# Altium project MISKO3 v1.0.PrjPcb (part 1 of 2)
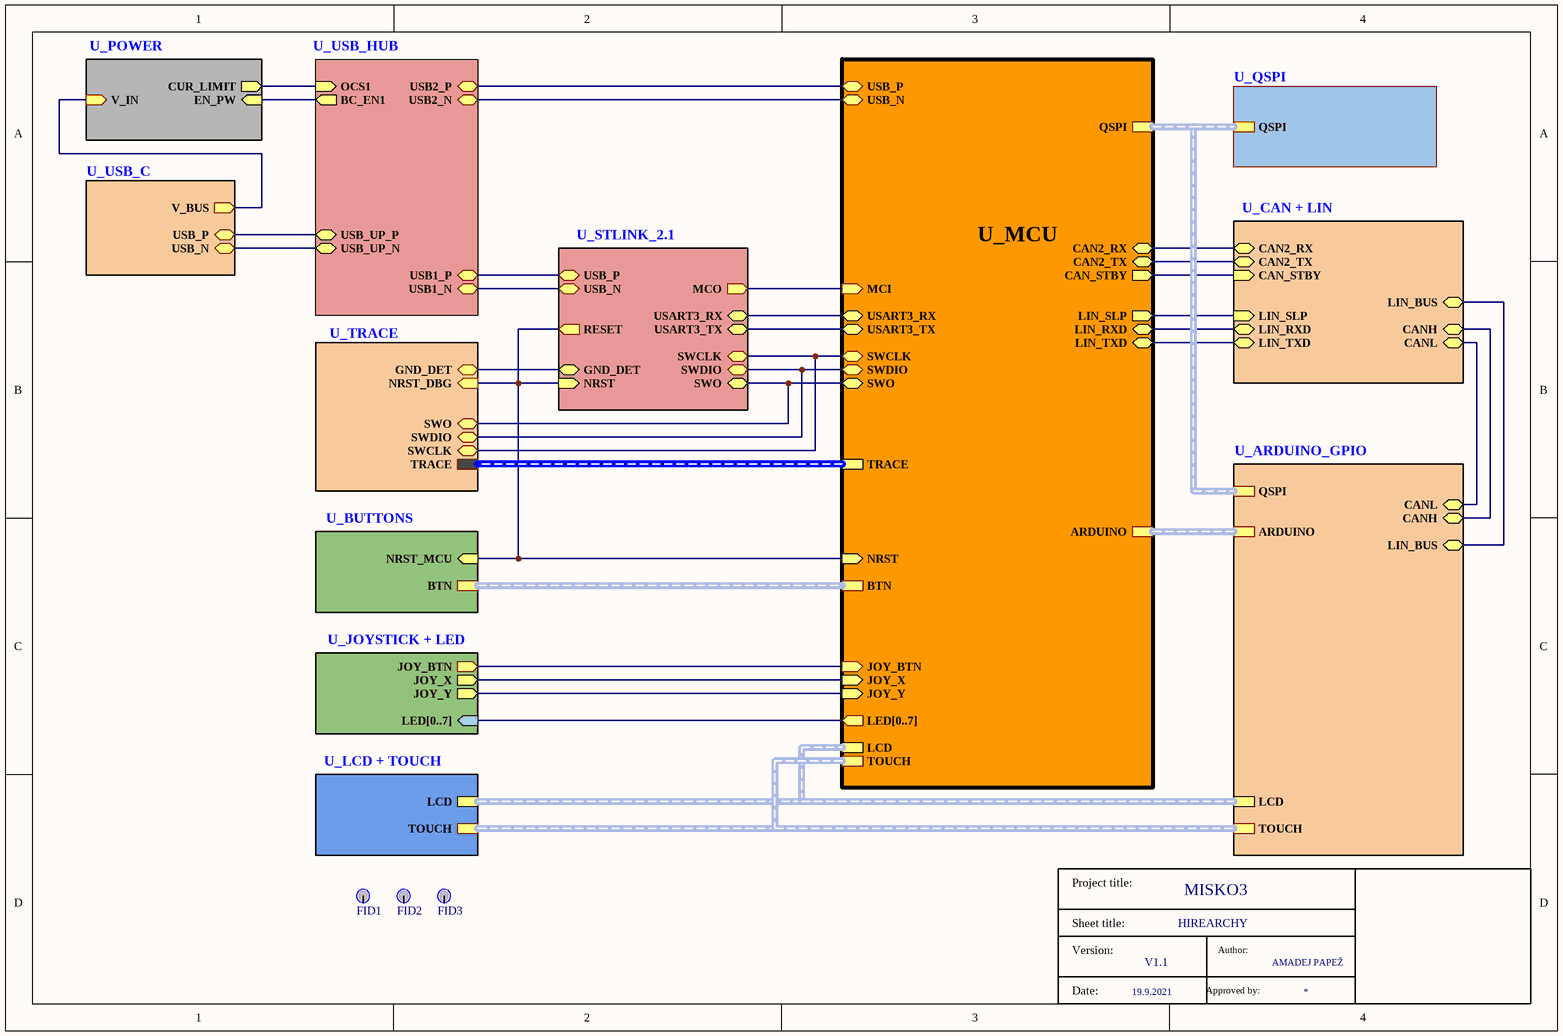
[diagram p0: HIREARCHY.SchDoc]
13 sheets, 243 parts. Net scope: hierarchical (ports join the sheet entries above them; power ports are global).
Board files: Misko 3 1.0.PcbDoc, Misko 3 1.0 panel.PcbDoc
Sheets:
  HIREARCHY.SchDoc
    U_BUTTONS = BUTTONS.SchDoc
    U_ARDUINO_GPIO = ARDUINO_GPIO.SchDoc
    U_POWER = POWER.SchDoc
    U_USB_HUB = USB_HUB.SchDoc
    U_JOYSTICK + LED = JOYSTICK + LED.SchDoc
    U_CAN + LIN = CAN + LIN.SchDoc
    U_STLINK_2.1 = STLINK_2.1.SchDoc
    U_MCU = MCU.SchDoc
    U_USB_C = USB_C.SchDoc
    U_QSPI = QSPI.SchDoc
    U_LCD + TOUCH = LCD + TOUCH .SchDoc
    U_TRACE = Trace.SchDoc

## Sheet HIREARCHY.SchDoc: MISKO3
size A4; Date: 19.9.2021; Author: AMADEJ PAPEŽ; SheetNumber: 1; SheetTotal: 13; SheetTitle: HIREARCHY; Version: V1.1

### Parts
FID1  Fiducial  [Fiducial]  (value not drawn)
FID2  Fiducial  [Fiducial]  (value not drawn)
FID3  Fiducial  [Fiducial]  (value not drawn)
T1  (no value)

### Sub-sheets
U_ARDUINO_GPIO = ARDUINO_GPIO.SchDoc: LIN_BUS (bidir), CANH (bidir), CANL (bidir), LCD (harness LCD), TOUCH (harness TOUCH), ARDUINO (harness ARDUINO), QSPI (harness QSPI)
U_BUTTONS = BUTTONS.SchDoc: NRST_MCU (in), BTN (harness BTN)
U_CAN + LIN = CAN + LIN.SchDoc: LIN_SLP (in), LIN_RXD (bidir), LIN_TXD (bidir), LIN_BUS (bidir), CAN_STBY (in), CAN2_TX (bidir), CAN2_RX (bidir), CANH (bidir), CANL (bidir)
U_JOYSTICK + LED = JOYSTICK + LED.SchDoc: JOY_X (out), JOY_Y (out), LED[0..7] (in, harness LED_BUS), JOY_BTN (out)
U_LCD + TOUCH = LCD + TOUCH .SchDoc: LCD (harness LCD), TOUCH (harness TOUCH)
U_MCU = MCU.SchDoc: CAN_STBY (out), JOY_Y (in), JOY_X (in), CAN2_TX (bidir), CAN2_RX (bidir), TRACE (harness TRACE), LIN_TXD (bidir), NRST (in), SWO (bidir), LIN_SLP (out), LIN_RXD (bidir), MCI (in), SWDIO (bidir), SWCLK (bidir), JOY_BTN (in), USB_N (bidir), USB_P (bidir), LCD (harness LCD), TOUCH (harness TOUCH), QSPI (harness QSPI), BTN (harness BTN), LED[0..7] (out, harness LED), ARDUINO (harness ARDUINO), USART3_TX (bidir), USART3_RX (bidir)
U_POWER = POWER.SchDoc: EN_PW (in), CUR_LIMIT (out), V_IN (in)
U_QSPI = QSPI.SchDoc: QSPI (harness QSPI)
U_STLINK_2.1 = STLINK_2.1.SchDoc: GND_DET (bidir), USART3_RX (bidir), USART3_TX (bidir), SWO (bidir), NRST (in), MCO (out), SWCLK (bidir), SWDIO (bidir), USB_P (bidir), USB_N (bidir), RESET (out)
U_TRACE = Trace.SchDoc: GND_DET (bidir), TRACE (harness TRACE), NRST_DBG (in), SWO (bidir), SWCLK (bidir), SWDIO (bidir)
U_USB_C = USB_C.SchDoc: USB_P (bidir), USB_N (bidir), V_BUS (out)
U_USB_HUB = USB_HUB.SchDoc: USB_UP_P (bidir), USB_UP_N (bidir), BC_EN1 (out), OCS1 (in), USB2_N (bidir), USB2_P (bidir), USB1_N (bidir), USB1_P (bidir)

### Nets
BC_EN1: sheet U_POWER/EN_PW, sheet U_USB_HUB/BC_EN1
CAN2_RX: sheet U_CAN + LIN/CAN2_RX, sheet U_MCU/CAN2_RX
CAN2_TX: sheet U_CAN + LIN/CAN2_TX, sheet U_MCU/CAN2_TX
CAN_STBY: sheet U_CAN + LIN/CAN_STBY, sheet U_MCU/CAN_STBY
CANH: sheet U_ARDUINO_GPIO/CANH, sheet U_CAN + LIN/CANH
CANL: sheet U_ARDUINO_GPIO/CANL, sheet U_CAN + LIN/CANL
CUR_LIMIT: sheet U_POWER/CUR_LIMIT, sheet U_USB_HUB/OCS1
JOY_BTN: sheet U_JOYSTICK + LED/JOY_BTN, sheet U_MCU/JOY_BTN
JOY_X: sheet U_JOYSTICK + LED/JOY_X, sheet U_MCU/JOY_X
JOY_Y: sheet U_JOYSTICK + LED/JOY_Y, sheet U_MCU/JOY_Y
LIN_BUS: sheet U_ARDUINO_GPIO/LIN_BUS, sheet U_CAN + LIN/LIN_BUS
LIN_SLP: sheet U_CAN + LIN/LIN_SLP, sheet U_MCU/LIN_SLP
MCI: sheet U_STLINK_2.1/MCO, sheet U_MCU/MCI
NRST: sheet U_BUTTONS/NRST_MCU, sheet U_STLINK_2.1/NRST, sheet U_STLINK_2.1/RESET, sheet U_MCU/NRST, sheet U_TRACE/NRST_DBG
STM_JRST: sheet U_STLINK_2.1/GND_DET, sheet U_TRACE/GND_DET
T_JTCK: sheet U_STLINK_2.1/SWCLK, sheet U_MCU/SWCLK, sheet U_TRACE/SWCLK
T_JTMS: sheet U_STLINK_2.1/SWDIO, sheet U_MCU/SWDIO, sheet U_TRACE/SWDIO
T_SWO: sheet U_STLINK_2.1/SWO, sheet U_MCU/SWO, sheet U_TRACE/SWO
USART3_RX: sheet U_STLINK_2.1/USART3_RX, sheet U_MCU/USART3_RX
USART3_TX: sheet U_STLINK_2.1/USART3_TX, sheet U_MCU/USART3_TX
USART5_RX: sheet U_CAN + LIN/LIN_RXD, sheet U_MCU/LIN_RXD
USART5_TX: sheet U_CAN + LIN/LIN_TXD, sheet U_MCU/LIN_TXD
USB2_N: sheet U_USB_HUB/USB2_N, sheet U_MCU/USB_N
USB2_P: sheet U_USB_HUB/USB2_P, sheet U_MCU/USB_P
USB_N: sheet U_USB_HUB/USB_UP_N, sheet U_USB_C/USB_N
USB_P: sheet U_USB_HUB/USB_UP_P, sheet U_USB_C/USB_P
USB_STLINK_N: sheet U_USB_HUB/USB1_N, sheet U_STLINK_2.1/USB_N
USB_STLINK_P: sheet U_USB_HUB/USB1_P, sheet U_STLINK_2.1/USB_P
V_BUS: sheet U_POWER/V_IN, sheet U_USB_C/V_BUS

Not connected (* = marked no-connect by the designer): FID1 F; FID2 F; FID3 F

### Buses and harness runs
harness sheet U_ARDUINO_GPIO/ARDUINO = sheet U_MCU/ARDUINO
harness sheet U_ARDUINO_GPIO/LCD = sheet U_LCD + TOUCH/LCD = sheet U_MCU/LCD
harness sheet U_ARDUINO_GPIO/QSPI = sheet U_MCU/QSPI = sheet U_QSPI/QSPI
harness sheet U_ARDUINO_GPIO/TOUCH = sheet U_LCD + TOUCH/TOUCH = sheet U_MCU/TOUCH
harness sheet U_BUTTONS/BTN = sheet U_MCU/BTN
harness sheet U_MCU/TRACE = sheet U_TRACE/TRACE

### Notes on the sheet
- (in symbol Title block) Project title:; Sheet title:; Version:; Author:; Date:; Approved by:

### Library data of the parts
FID1-FID3 = Fiducial: according to IPC-7351 - is a 1mm diameter round dot with 2mm solder mask opening; Voltage: 50V; Tolerance: 5%; max.Temperature: +125; min.Temperature: -40
T1 = Title block

## Sheet BUTTONS.SchDoc: MISKO 3.0
size A4; Date: 19.9.2021; Author: AMADEJ PAPEŽ; SheetNumber: 10; SheetTotal: 13; SheetTitle: BUTTONS; Version: V1.1
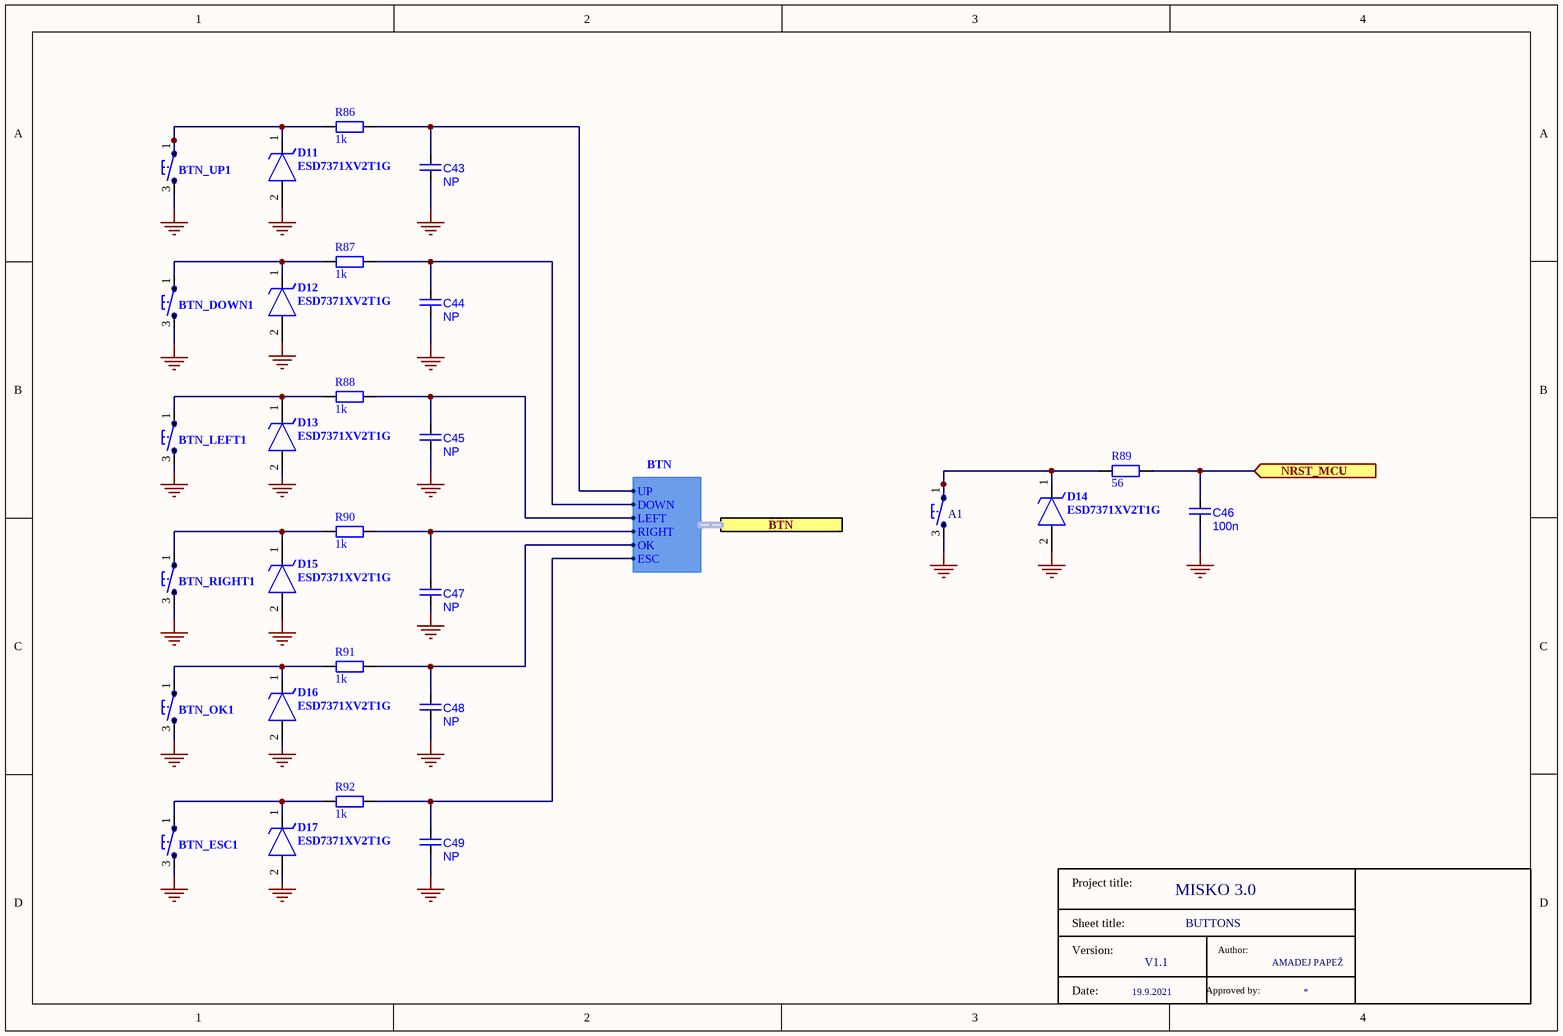
[diagram p1: BUTTONS.SchDoc]

### Parts
A1  Button_6x6  [Tipka 6x6]  (value not drawn)
BTN_DOWN1  Button_6x6  [Tipka 6x6]  (value not drawn)
BTN_ESC1  Button_6x6  [Tipka 6x6]  (value not drawn)
BTN_LEFT1  Button_6x6  [Tipka 6x6]  (value not drawn)
BTN_OK1  Button_6x6  [Tipka 6x6]  (value not drawn)
BTN_RIGHT1  Button_6x6  [Tipka 6x6]  (value not drawn)
BTN_UP1  Button_6x6  [Tipka 6x6]  (value not drawn)
C43  value NP  [C0603]
C44  value NP  [C0603]
C45  value NP  [C0603]
C46  value 100n  [C0603]
C47  value NP  [C0603]
C48  value NP  [C0603]
C49  value NP  [C0603]
D11  ESD7371XV2T1G  [SOD1608X70N]
D12  ESD7371XV2T1G  [SOD1608X70N]
D13  ESD7371XV2T1G  [SOD1608X70N]
D14  ESD7371XV2T1G  [SOD1608X70N]
D15  ESD7371XV2T1G  [SOD1608X70N]
D16  ESD7371XV2T1G  [SOD1608X70N]
D17  ESD7371XV2T1G  [SOD1608X70N]
R86  value 1k  [R1608_0603I_L]
R87  value 1k  [R1608_0603I_L]
R88  value 1k  [R1608_0603I_L]
R89  value 56  [R1608_0603I_L]
R90  value 1k  [R1608_0603I_L]
R91  value 1k  [R1608_0603I_L]
R92  value 1k  [R1608_0603I_L]
T10  (no value)

### Ports
BTN (harness BTN), NRST_MCU (in)

### Harnesses
BTN: LEFT, DOWN, RIGHT, UP, OK, ESC

### Nets
GND: A1.3 BTN_DOWN1.3 BTN_ESC1.3 BTN_LEFT1.3 BTN_OK1.3 BTN_RIGHT1.3 BTN_UP1.3 C43.1 C44.1 C45.1 C46.1 C47.1 C48.1 C49.1 D11.2(A) D12.2(A) D13.2(A) D14.2(A) D15.2(A) D16.2(A) D17.2(A)
NRST: C46.2 R89.1 ; port NRST_MCU
NetA1_1: A1.1 D14.1(K) R89.2
NetBTN_DOWN1_1: BTN_DOWN1.1 D12.1(K) R87.2
NetBTN_ESC1_1: BTN_ESC1.1 D17.1(K) R92.2
NetBTN_LEFT1_1: BTN_LEFT1.1 D13.1(K) R88.2
NetBTN_OK1_1: BTN_OK1.1 D16.1(K) R91.2
NetBTN_RIGHT1_1: BTN_RIGHT1.1 D15.1(K) R90.2
NetBTN_UP1_1: BTN_UP1.1 D11.1(K) R86.2
NetC43_2: C43.2 R86.1 ; port BTN.UP
NetC44_2: C44.2 R87.1 ; port BTN.DOWN
NetC45_2: C45.2 R88.1 ; port BTN.LEFT
NetC47_2: C47.2 R90.1 ; port BTN.RIGHT
NetC48_2: C48.2 R91.1 ; port BTN.OK
NetC49_2: C49.2 R92.1 ; port BTN.ESC

### Notes on the sheet
- (in symbol Title block) Project title:; Sheet title:; Version:; Author:; Date:; Approved by:

### Library data of the parts
A1 = Button_6x6: Tactile switch SMD; pin to pad: 1>1+2 3>3+4; Code: Q-PBUTTON; Value: Reset
BTN_DOWN1 BTN_ESC1 BTN_LEFT1 BTN_OK1 BTN_RIGHT1 BTN_UP1 = Button_6x6: Tactile switch SMD; pin to pad: 1>1+2 3>3+4; Code: Q-PBUTTON; Value: UI
C43-C49 = C: Capacitor; Code: NB6-100N
D11-D17 = ESD7371XV2T1G: TVS Diode (Uni-directional); Manufacturer_Name: ON Semiconductor; Code: KD-ESD7371X; Datasheet Link: http://www.onsemi.com/pub/Collateral/ESD7371-D.PDF; Height: 0.7mm; Manufacturer_Part_Number: ESD7371XV2T1G; Mouser Part Number: 863-ESD7371XV2T1G; Mouser Price/Stock: https://www.mouser.co.uk/ProductDetail/ON-Semiconductor/ESD7371XV2T1G?qs=dbuNSGnowt2%2F4vd%2Frk8Hiw%3D%3D; Arrow Part Number: ESD7371XV2T1G; Arrow Price/Stock: https://www.arrow.com/en/products/esd7371xv2t1g/on-semiconductor
R86-R88 R90-R92 = R: Code: LC4-1K
R89 = R: Code: LC2-56E
T10 = Title block

## Sheet ARDUINO_GPIO.SchDoc: MISKO 3.0
size A4; Date: 19.9.2021; Author: AMADEJ PAPEŽ; SheetNumber: 6; SheetTotal: 13; Version: V1.1; SheetTitle: ARDUINO_GPIO
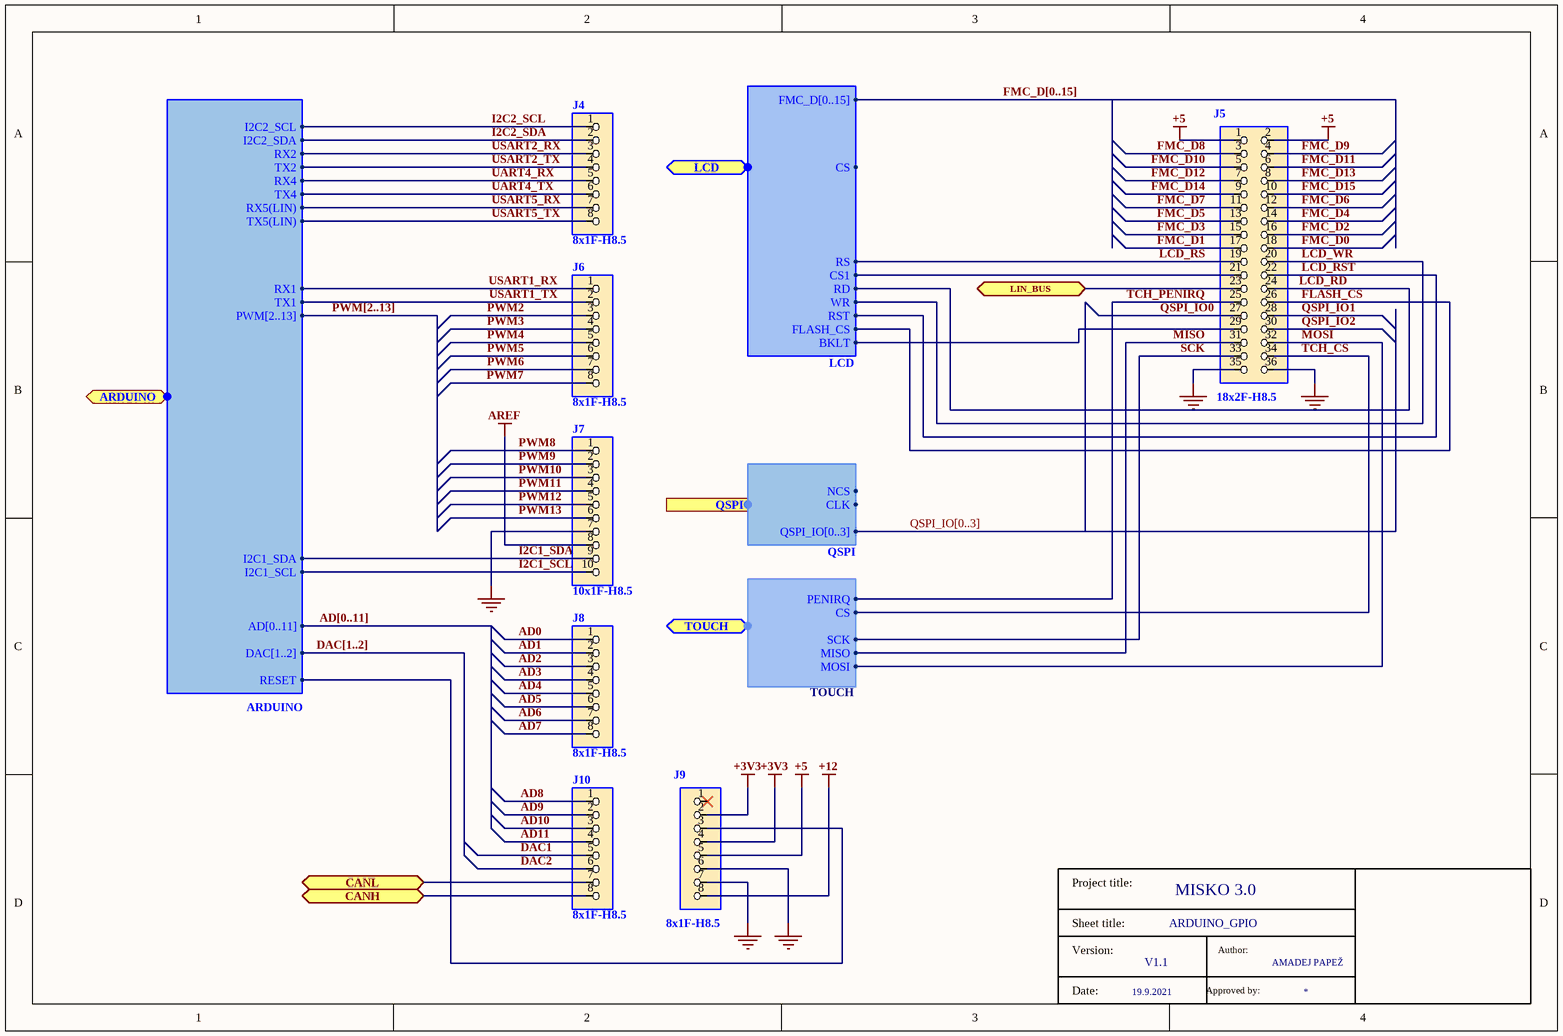
[diagram p2: ARDUINO_GPIO.SchDoc]

### Parts
J4  8x1F-H8.5  [1X08]
J5  18x2F-H8.5  [2X18]
J6  8x1F-H8.5  [1X08]
J7  10x1F-H8.5  [1X10]
J8  8x1F-H8.5  [1X08]
J9  8x1F-H8.5  [1X08]
J10  8x1F-H8.5  [1X08]
T6  (no value)

### Ports
ARDUINO (bidir, harness ARDUINO), CANH (bidir), CANL (bidir), LCD (bidir, harness LCD), LIN_BUS (bidir), QSPI (harness QSPI), TOUCH (bidir, harness TOUCH)

### Harnesses
ARDUINO: PWM[2..13], DAC[1..2], TX1, RX1, TX4, RX4, TX2, RX2, I2C2_SDA, I2C2_SCL, I2C1_SDA, I2C1_SCL, AD[0..11], TX5(LIN), RX5(LIN), RESET
TOUCH: PENIRQ, CS, SCK, MISO, MOSI
LCD: FMC_D[0..15], RST, BKLT, RD, WR, RS, CS, FLASH_CS, CS1
QSPI: NCS, CLK, QSPI_IO[0..3]

### Nets
+3V3: J9.2 J9.4
+5: J5.1 J5.2 J9.5
+12: J9.8
AREF: J7.8
GND: J5.35 J5.36 J7.7 J9.6 J9.7
AD0: J8.1
AD1: J8.2
AD2: J8.3
AD3: J8.4
AD4: J8.5
AD5: J8.6
AD6: J8.7
AD7: J8.8
AD8: J10.1
AD9: J10.2
AD10: J10.3
AD11: J10.4
ARDUINO_CS: J5.21 ; port LCD.CS1
CANH: J10.8 ; port CANH
CANL: J10.7 ; port CANL
DAC1: J10.5
DAC2: J10.6
FLASH_CS: J5.26 ; port LCD.FLASH_CS
FMC_D0: J5.18
FMC_D1: J5.17
FMC_D2: J5.16
FMC_D3: J5.15
FMC_D4: J5.14
FMC_D5: J5.13
FMC_D6: J5.12
FMC_D7: J5.11
FMC_D8: J5.3
FMC_D9: J5.4
FMC_D10: J5.5
FMC_D11: J5.6
FMC_D12: J5.7
FMC_D13: J5.8
FMC_D14: J5.9
FMC_D15: J5.10
I2C1_SCL: J7.10 ; port ARDUINO.I2C1_SCL
I2C1_SDA: J7.9 ; port ARDUINO.I2C1_SDA
I2C2_SCL: J4.1 ; port ARDUINO.I2C2_SCL
I2C2_SDA: J4.2 ; port ARDUINO.I2C2_SDA
LCD_BKLT: J5.29 ; port LCD.BKLT
LCD_RD: J5.24 ; port LCD.RD
LCD_RS: J5.19 ; port LCD.RS
LCD_RST: J5.22 ; port LCD.RST
LCD_WR: J5.20 ; port LCD.WR
LIN_BUS: J5.23 ; port LIN_BUS
MISO: J5.31 ; port TOUCH.MISO
MOSI: J5.32 ; port TOUCH.MOSI
NRST: J9.3 ; port ARDUINO.RESET
PWM2: J6.3
PWM3: J6.4
PWM4: J6.5
PWM5: J6.6
PWM6: J6.7
PWM7: J6.8
PWM8: J7.1
PWM9: J7.2
PWM10: J7.3
PWM11: J7.4
PWM12: J7.5
PWM13: J7.6
QSPI_IO0: J5.27
QSPI_IO1: J5.28
QSPI_IO2: J5.30
SCK: J5.33 ; port TOUCH.SCK
TCH_CS: J5.34 ; port TOUCH.CS
TCH_PENIRQ: J5.25 ; port TOUCH.PENIRQ
UART4_RX: J4.5 ; port ARDUINO.RX4
UART4_TX: J4.6 ; port ARDUINO.TX4
USART1_RX: J6.1 ; port ARDUINO.RX1
USART1_TX: J6.2 ; port ARDUINO.TX1
USART2_RX: J4.3 ; port ARDUINO.RX2
USART2_TX: J4.4 ; port ARDUINO.TX2  [project net T_SWO]
USART5_RX: J4.7 ; port ARDUINO.RX5(LIN)
USART5_TX: J4.8 ; port ARDUINO.TX5(LIN)

Not connected (* = marked no-connect by the designer): J9 1*

### Buses and harness runs
bus AD[0..11]
bus DAC[1..2]
bus FMC_D[0..15]
bus PWM[2..13]
bus QSPI_IO[0..3]

### Notes on the sheet
- (in symbol Title block) Project title:; Sheet title:; Version:; Author:; Date:; Approved by:

### Library data of the parts
J4 J6 J8-J10 = PINHD-1X8
J5 = PINHD-2X18
J7 = PINHD-1X10
T6 = Title block

## Sheet POWER.SchDoc: MISKO 3.0
size A4; Date: 19.9.2021; Author: AMADEJ PAPEŽ; SheetNumber: 3; SheetTotal: 13; Version: V1.1; SheetTitle: POWER
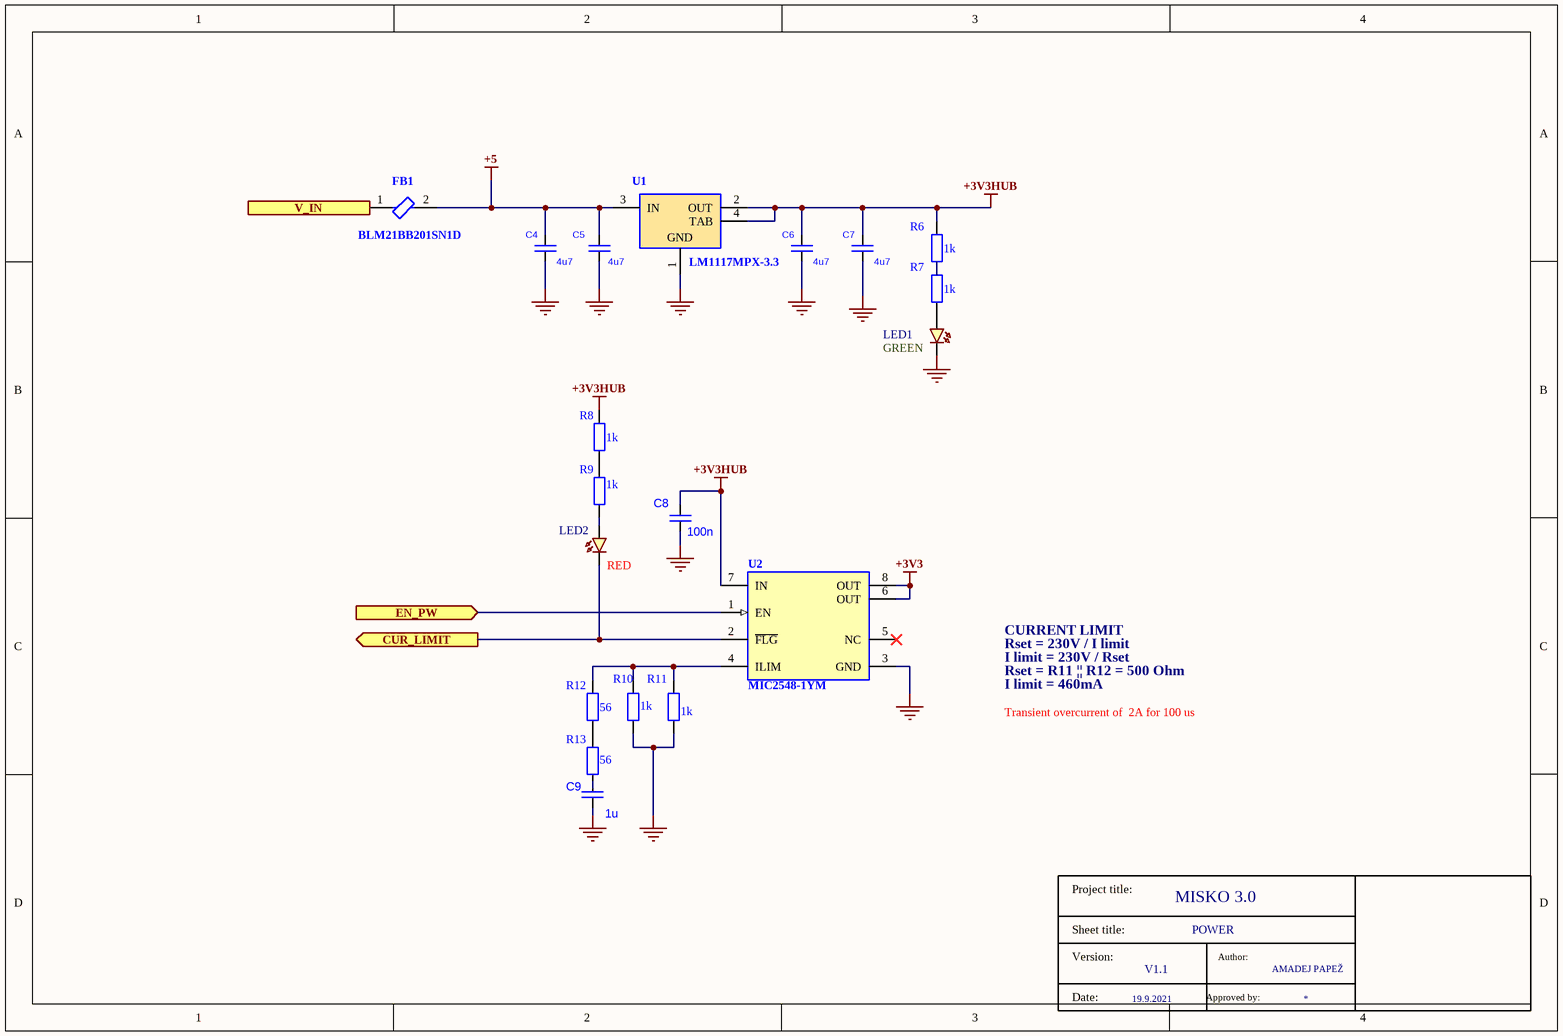
[diagram p3: POWER.SchDoc]

### Parts
C4  value 4u7  [C0603]
C5  value 4u7  [C0603]
C6  value 4u7  [C0603]
C7  value 4u7  [C0603]
C8  value 100n  [C0603]
C9  value 1u  [C0603]
FB1  BLM21BB201SN1D  [BLM2102FB0805]
LED1  GREEN  [LED0603]
LED2  RED  [LED0603]
R6  value 1k  [R1608_0603I_L]
R7  value 1k  [R1608_0603I_L]
R8  value 1k  [R1608_0603I_L]
R9  value 1k  [R1608_0603I_L]
R10  value 1k  [R1608_0603I_L]
R11  value 1k  [R1608_0603I_L]
R12  value 56  [R1608_0603I_L]
R13  value 56  [R1608_0603I_L]
T3  (no value)
U1  LM1117MPX-3.3  [DCY0004A_M]
U2  MIC2548-1YM  [SOIC_8_MIC2544]

### Ports
CUR_LIMIT (out), EN_PW (in), V_IN (in)

### Nets
+3V3: U2.6(OUT) U2.8(OUT)
+3V3HUB: C6.2 C7.2 C8.2 R6.1 R8.2 U1.2(OUT) U1.4(TAB) U2.7(IN)
+5: C4.2 C5.2 FB1.2 U1.3(IN)
GND: C4.1 C5.1 C6.1 C7.1 C8.1 C9.1 LED1.1(KATODE) R10.1 R11.1 U1.1(GND) U2.3(GND)
BC_EN1: U2.1(EN) ; port EN_PW
CUR_LIMIT: LED2.1(KATODE) U2.2(~{FLG}) ; port CUR_LIMIT
V_BUS: FB1.1 ; port V_IN
NetC9_2: C9.2 R13.1
NetLED1_2: LED1.2(ANODE) R7.2
NetLED2_2: LED2.2(ANODE) R9.1
NetR6_2: R6.2 R7.1
NetR8_1: R8.1 R9.2
NetR10_2: R10.2 R11.2 R12.2 U2.4(ILIM)
NetR12_1: R12.1 R13.2

Not connected (* = marked no-connect by the designer): U2 5(NC)*

### Notes on the sheet
- Rset = 230V / I limit
- CURRENT LIMIT
- I limit = 230V / Rset
- Rset = R11 || R12 = 500 Ohm
- I limit = 460mA
- Transient overcurrent of  2A for 100 us
- (in symbol Title block) Project title:; Sheet title:; Version:; Author:; Date:; Approved by:

### Library data of the parts
C4-C7 = C: Capacitor; Code: NB7-4U7-25V
C8 = C: Capacitor; Code: NB6-100N
C9 = C: Capacitor; Code: NB7-1U-25V
FB1 = BLM21BB201SN1D: Chip Ferrite Bead, 0805, 200Ω @ 100MHz, 0.26Ω, 25%, 500mA; Number of Circuits: 1; Shielding: Unshielded; DC Resistance (DCR): 260mR; Material: Steel; DC Resistance-Max: 350mR; Impedance: 200R; Max DC Current: 200mA; Code: LZ-FB0805; Max Operating Temperature: 125°C; Packaging: Tape and Reel; REACH SVHC: No SVHC; Depth: 1.25mm; Core Material: Ferrite; Case Code (Metric): 2012; Termination: SMD/SMT; Series: BLM21B; Number of Lines: 1; Max Current Rating: 500mA; Package Quantity: 4000; Lead Free: Lead Free; Test Frequency: 100MHz; Case Code (Imperial): 0805; Number of Pins: 2; Height: 0.85mm; Tolerance: 25%; Width: 1.25mm; Case/Package: 0805; Min Operating Temperature: -55°C; Current Rating: 500mA; Length: 2mm
LED1 = LED: Green light-emitting diode; Code: KLC-G
LED2 = LED: Red light-emitting diode; Code: KLC-R
R6-R11 = R: Code: LC4-1K
R12 R13 = R: Code: LC2-56E
T3 = Title block
U1 = LM1117MPX-3.3: 800mA Low-Dropout Linear Regulator, 4-pin SOT-223, Pb-Free / DataSheet: / https://www.ti.com/lit/ds/symlink/lm1117.pdf?ts=1629838143263&ref_url=https%253A%252F%252Fwww.google.com%252F; PartNumber: LM1117MPX-3.3/NOPB; Manufacturer: Texas Instruments; High-Reliability: Y; PowerWise: N; PackageTopMarking: XYTT*N05A; CompType: LDO IC; Code: FRL-33-LM1117; ComponentLink1URL: http://www.ti.com/general/docs/lit/getliterature.tsp?genericPartNumber=LM1117-N&fileType=pdf; ComponentLink1Description: Datasheet URL; PinCount: 4; Code_JEDEC: TO-261-AA; PackageDescription: Molded SOT-223, 6.50 x 3.56 x 1.6mm Body, 4 Lead, 2.3mm Pitch; PackageReference: DCY0004A; RoHS: Y; Code_IPC: SOT223-4
U2 = MIC2544-1YM: IC PWR SWITCH N-CHAN 1:1 8MSOP / DataSheet: / https://ww1.microchip.com/downloads/en/DeviceDoc/20005725B.pdf; Manufacturer Part Number: MIC2544-1YMM-TR; Turn-On Delay Time: 5ms; Interface: On/Off; Output Configuration: High Side; Rated Current-Max: 1.5A; Number of Switches: 1; Min Supply Voltage: 2.7V; On-state Resistance-Max: 120MR; Nominal Supply Current: 5uA; Fault Protection: Over Temperature; Turn-Off Delay Time: 22us; Max Supply Voltage: 5.5V; Code: FS-MIC2544; Max Operating Temperature: 85°C; Series: -; Package Quantity: 2500; On-State Resistance: 120mR; Max Output Current: 1.5A; Radiation Hardening: No; Case/Package: MSOP; Min Operating Temperature: -40°C; Number of Outputs: 1; Current Rating: 1.5A; Mount: Surface Mount; Number of Pins: 8; Supply Current: 5uA; Packaging: Tape and Reel; Manufacturer: Microchip

## Sheet USB_HUB.SchDoc: MISKO 3.0
size A4; Date: 19.9.2021; Author: AMADEJ PAPEŽ; SheetNumber: 4; SheetTotal: 13; SheetTitle: USB_HUB; Version: V1.1
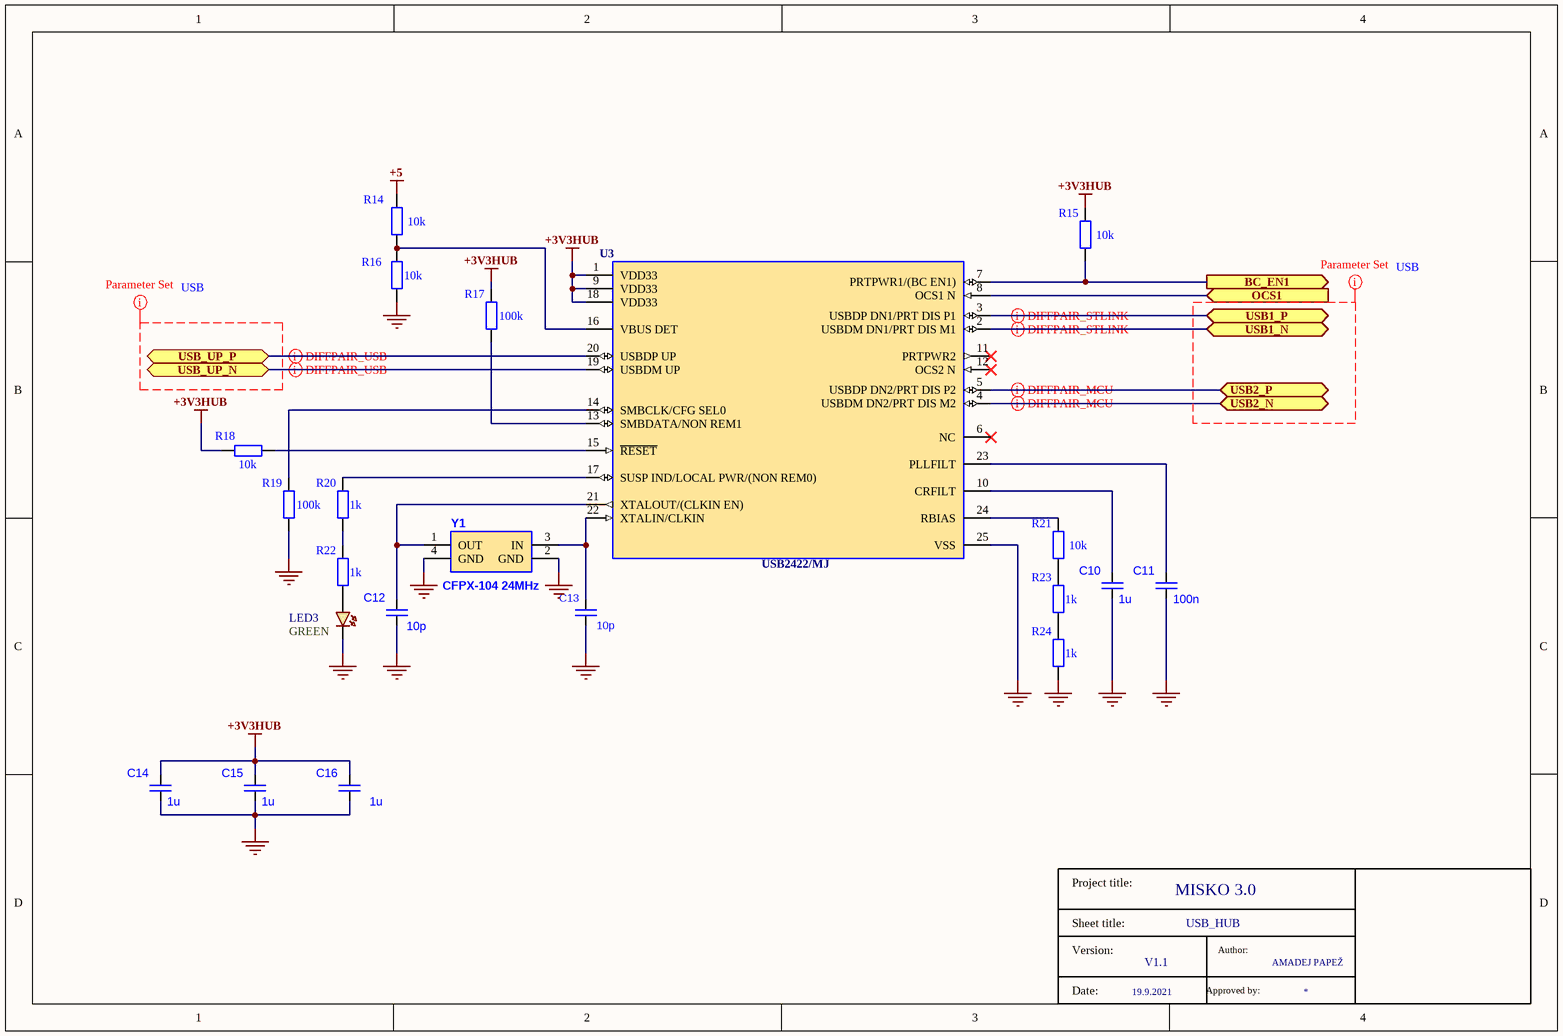
[diagram p4: USB_HUB.SchDoc]

### Parts
C10  value 1u  [C0603]
C11  value 100n  [C0603]
C12  value 10p  [C0603]
C13  value 10p  [C0603]
C14  value 1u  [C0603]
C15  value 1u  [C0603]
C16  value 1u  [C0603]
LED3  GREEN  [LED0603]
R14  value 10k  [R1608_0603I_L]
R15  value 10k  [R1608_0603I_L]
R16  value 10k  [R1608_0603I_L]
R17  value 100k  [R1608_0603I_L]
R18  value 10k  [R1608_0603I_L]
R19  value 100k  [R1608_0603I_L]
R20  value 1k  [R1608_0603I_L]
R21  value 10k  [R1608_0603I_L]
R22  value 1k  [R1608_0603I_L]
R23  value 1k  [R1608_0603I_L]
R24  value 1k  [R1608_0603I_L]
T4  (no value)
U3  USB2422/MJ  [FP-24-S4QFN-4x4B-0_5P-IPC_C]
Y1  CFPX-104 24MHz  [ABM3B24MHZB2T]

### Ports
BC_EN1 (out), OCS1 (in), USB1_N (bidir), USB1_P (bidir), USB2_N (bidir), USB2_P (bidir), USB_UP_N (bidir), USB_UP_P (bidir)

### Nets
+3V3HUB: C14.2 C15.2 C16.2 R15.2 R17.1 R18.2 U3.1(VDD33) U3.9(VDD33) U3.18(VDD33)
+5: R14.2
GND: C10.2 C11.2 C12.1 C13.1 C14.1 C15.1 C16.1 LED3.1(KATODE) R16.1 R19.1 R24.1 U3.25(VSS) Y1.2(GND) Y1.4(GND)
BC_EN1: R15.1 U3.7(PRTPWR1/(BC_EN1)) ; port BC_EN1
CUR_LIMIT: U3.8(OCS1_N) ; port OCS1
USB2_N: U3.4(USBDM_DN2/PRT_DIS_M2) ; port USB2_N
USB2_P: U3.5(USBDP_DN2/PRT_DIS_P2) ; port USB2_P
USB_N: U3.19(USBDM_UP) ; port USB_UP_N
USB_P: U3.20(USBDP_UP) ; port USB_UP_P
USB_STLINK_N: U3.2(USBDM_DN1/PRT_DIS_M1) ; port USB1_N
USB_STLINK_P: U3.3(USBDP_DN1/PRT_DIS_P1) ; port USB1_P
NetC10_1: C10.1 U3.10(CRFILT)
NetC11_1: C11.1 U3.23(PLLFILT)
NetC12_2: C12.2 U3.21(XTALOUT/(CLKIN_EN)) Y1.1(OUT)
NetC13_2: C13.2 U3.22(XTALIN/CLKIN) Y1.3(IN)
NetLED3_2: LED3.2(ANODE) R22.2
NetR14_1: R14.1 R16.2 U3.16(VBUS_DET)
NetR17_2: R17.2 U3.13(SMBDATA/NON_REM1)
NetR18_1: R18.1 U3.15(~{RESET})
NetR19_2: R19.2 U3.14(SMBCLK/CFG_SEL0)
NetR20_1: R20.1 U3.17(SUSP_IND/LOCAL_PWR/(NON_REM0))
NetR20_2: R20.2 R22.1
NetR21_1: R21.1 U3.24(RBIAS)
NetR21_2: R21.2 R23.2
NetR23_1: R23.1 R24.2

Not connected (* = marked no-connect by the designer): U3 6(NC)* 11(PRTPWR2)* 12(OCS2_N)*

### Layout directives
differential pair: USB2_N, USB2_P, USB_N, USB_P, USB_STLINK_N, USB_STLINK_P
net class USB: (no net found under the mark)

### Notes on the sheet
- (in symbol Title block) Project title:; Sheet title:; Version:; Author:; Date:; Approved by:

### Library data of the parts
C10 C14-C16 = C: Capacitor; Code: NB7-1U-25V
C11 = C: Capacitor; Code: NB6-100N
C12 C13 = C: Capacitor; Code: NB2-10P
LED3 = LED: Green light-emitting diode; Code: KLC-G
R14-R16 R18 R21 = R: Code: LC5-10K
R17 R19 = R: Code: LC6-100K
R20 R22-R24 = R: Code: LC4-1K
T4 = Title block
U3 = USB2422/MJ: IC HUB CTLR USB 2.0 24QFN / DataSheet: / http://ww1.microchip.com/downloads/en/devicedoc/00001726b.pdf; Operating Supply Voltage: 3.3V; Data Rate: 480Mbps; Number of Ports: 2; Interface: I2C; Operating Supply Current: 70mA; Code: FC-USB2422MJ; Case/Package: QFN; Packaging: Bulk; Package Quantity: 490; Lead Free: Lead Free; Min Operating Temperature: 0°C; Number of Pins: 24; RoHS Compliant: Yes; Max Operating Temperature: 70°C
Y1 = ABM3B-24MHZ-B-2-T: ComponentLink1Description: New link; ComponentLink1URL: https://www.we-online.com/catalog/datasheet/830032817.pdf; Supplier 1: Würth elektronik; Supplier part number 1: 830032817

## Sheet JOYSTICK + LED.SchDoc: MISKO 3.0
size A4; Date: 19.9.2021; Author: AMADEJ PAPEŽ; SheetNumber: 9; SheetTotal: 13; SheetTitle: JOYSTICK + LED; Version: V1.1
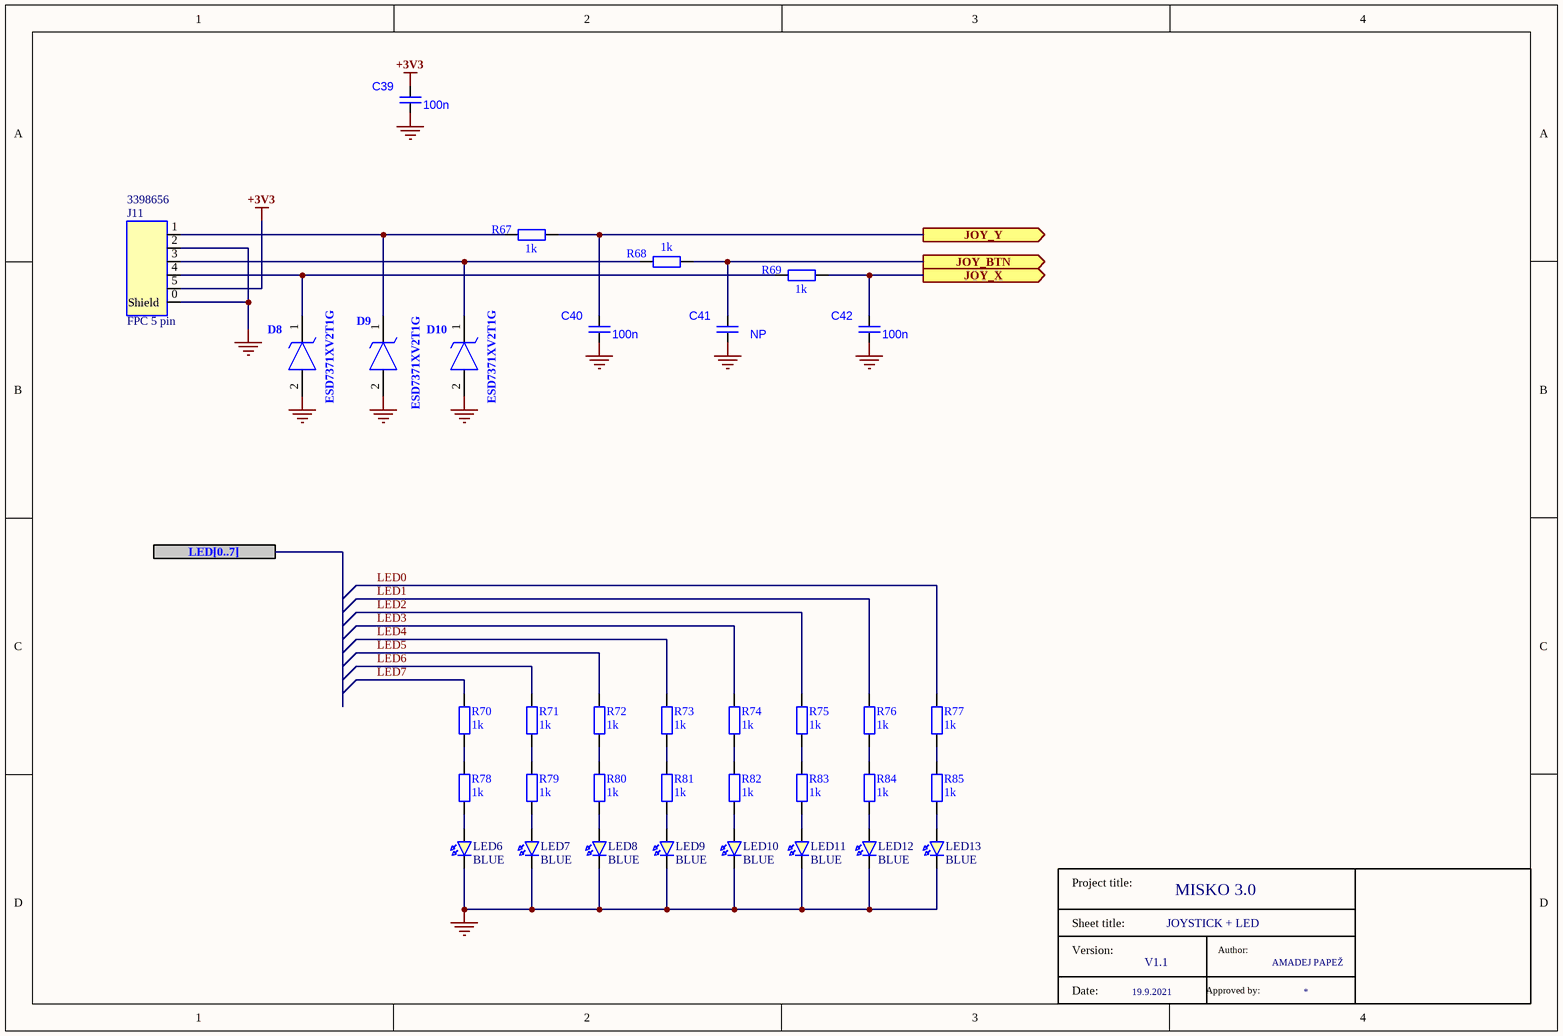
[diagram p5: JOYSTICK + LED.SchDoc]

### Parts
C39  value 100n  [C0603]
C40  value 100n  [C0603]
C41  value NP  [C0603]
C42  value 100n  [C0603]
D8  ESD7371XV2T1G  [SOD1608X70N]
D9  ESD7371XV2T1G  [SOD1608X70N]
D10  ESD7371XV2T1G  [SOD1608X70N]
J11  FPC 5 pin  Supplier Part Number 1: 3398656  [FPC 1734839-5]
LED6  BLUE  [LED1206]
LED7  BLUE  [LED1206]
LED8  BLUE  [LED1206]
LED9  BLUE  [LED1206]
LED10  BLUE  [LED1206]
LED11  BLUE  [LED1206]
LED12  BLUE  [LED1206]
LED13  BLUE  [LED1206]
R67  value 1k  [R1608_0603I_L]
R68  value 1k  [R1608_0603I_L]
R69  value 1k  [R1608_0603I_L]
R70  value 1k  [R1608_0603I_L]
R71  value 1k  [R1608_0603I_L]
R72  value 1k  [R1608_0603I_L]
R73  value 1k  [R1608_0603I_L]
R74  value 1k  [R1608_0603I_L]
R75  value 1k  [R1608_0603I_L]
R76  value 1k  [R1608_0603I_L]
R77  value 1k  [R1608_0603I_L]
R78  value 1k  [R1608_0603I_L]
R79  value 1k  [R1608_0603I_L]
R80  value 1k  [R1608_0603I_L]
R81  value 1k  [R1608_0603I_L]
R82  value 1k  [R1608_0603I_L]
R83  value 1k  [R1608_0603I_L]
R84  value 1k  [R1608_0603I_L]
R85  value 1k  [R1608_0603I_L]
T9  (no value)

### Ports
JOY_BTN (out), JOY_X (out), JOY_Y (out), LED[0..7] (harness LED_BUS)

### Nets
+3V3: C39.2 J11.5
GND: C39.1 C40.1 C41.1 C42.1 D8.2(A) D9.2(A) D10.2(A) J11.0(Shield) J11.2 LED6.1(KATODE) LED7.1(KATODE) LED8.1(KATODE) LED9.1(KATODE) LED10.1(KATODE) LED11.1(KATODE) LED12.1(KATODE) LED13.1(KATODE)
JOY_BTN: C41.2 R68.1 ; port JOY_BTN
JOY_X: C42.2 R69.1 ; port JOY_X
JOY_Y: C40.2 R67.1 ; port JOY_Y
LED0: R77.2  [project net LED0_9]
LED1: R76.2  [project net LED1_9]
LED2: R75.2  [project net LED2_9]
LED3: R74.2  [project net LED3_9]
LED4: R73.2  [project net LED4_9]
LED5: R72.2  [project net LED5_9]
LED6: R71.2  [project net LED6_9]
LED7: R70.2  [project net LED7_9]
NetD8_1: D8.1(K) J11.4 R69.2
NetD9_1: D9.1(K) J11.1 R67.2
NetD10_1: D10.1(K) J11.3 R68.2
NetLED6_2: LED6.2(ANODE) R78.1
NetLED7_2: LED7.2(ANODE) R79.1
NetLED8_2: LED8.2(ANODE) R80.1
NetLED9_2: LED9.2(ANODE) R81.1
NetLED10_2: LED10.2(ANODE) R82.1
NetLED11_2: LED11.2(ANODE) R83.1
NetLED12_2: LED12.2(ANODE) R84.1
NetLED13_2: LED13.2(ANODE) R85.1
NetR70_1: R70.1 R78.2
NetR71_1: R71.1 R79.2
NetR72_1: R72.1 R80.2
NetR73_1: R73.1 R81.2
NetR74_1: R74.1 R82.2
NetR75_1: R75.1 R83.2
NetR76_1: R76.1 R84.2
NetR77_1: R77.1 R85.2

### Notes on the sheet
- (in symbol Title block) Project title:; Sheet title:; Version:; Author:; Date:; Approved by:

### Library data of the parts
C39-C42 = C: Capacitor; Code: NB6-100N
D8-D10 = ESD7371XV2T1G: as D11 on sheet BUTTONS; Datasheet Link: http://www.onsemi.com/pub/Collateral/ESD7371-D.PDF; Height: 0.7mm; Manufacturer_Part_Number: ESD7371XV2T1G; Mouser Part Number: 863-ESD7371XV2T1G; Mouser Price/Stock: https://www.mouser.co.uk/ProductDetail/ON-Semiconductor/ESD7371XV2T1G?qs=dbuNSGnowt2%2F4vd%2Frk8Hiw%3D%3D; Arrow Part Number: ESD7371XV2T1G; Arrow Price/Stock: https://www.arrow.com/en/products/esd7371xv2t1g/on-semiconductor
J11 = FPC 1734839-5: TE connectivity  FPC 5 pin 0.5 mm ZIF top contact female connector 1734839-5; Supplier 1: Farnell
LED6-LED13 = LED: Code: KLB-B
R67-R85 = R: Code: LC4-1K
T9 = Title block

## Sheet CAN + LIN.SchDoc: MISKO 3.0
size A4; Date: 19.9.2021; Author: AMADEJ PAPEŽ; SheetNumber: 8; SheetTotal: 13; Version: V1.1; SheetTitle: CAN + LIN
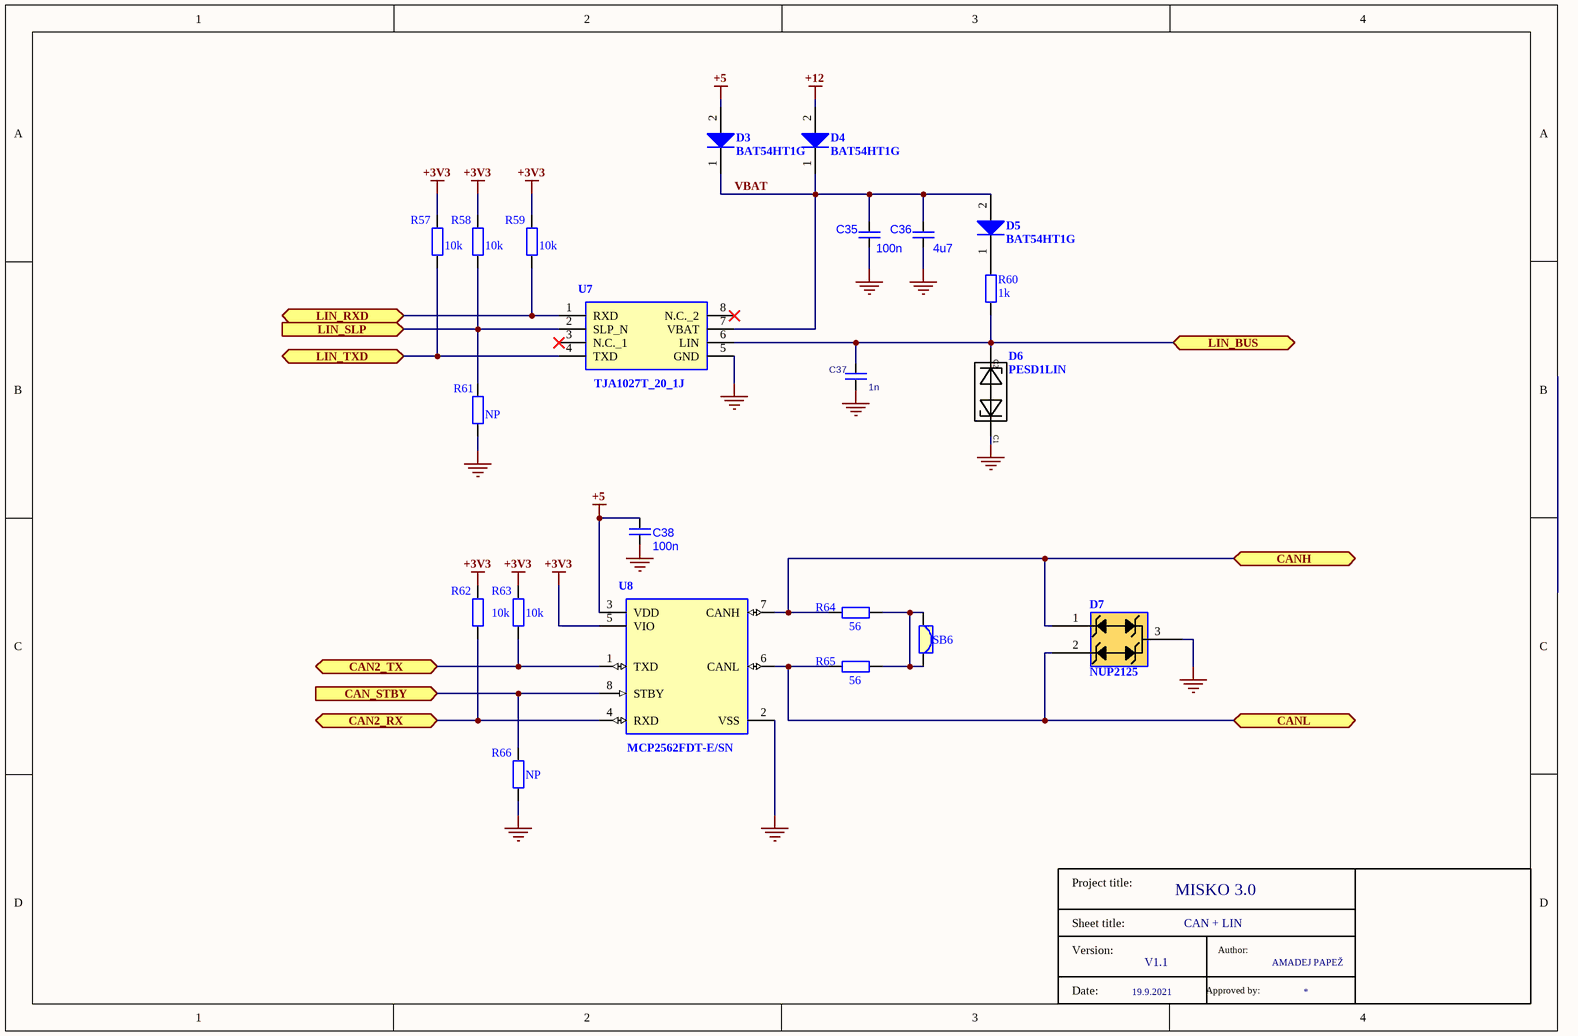
[diagram p6: CAN + LIN.SchDoc]

### Parts
C35  value 100n  [C0603]
C36  value 4u7  [C0603]
C37  value 1n  [C0603]
C38  value 100n  [C0603]
D3  BAT54HT1G  [ONSC-SOD-323-2-477-02_V]
D4  BAT54HT1G  [ONSC-SOD-323-2-477-02_V]
D5  BAT54HT1G  [ONSC-SOD-323-2-477-02_V]
D6  PESD1LIN  [PESD1LIN_footprint]
D7  NUP2125  [SOT23127P600-8N]
R57  value 10k  [R1608_0603I_L]
R58  value 10k  [R1608_0603I_L]
R59  value 10k  [R1608_0603I_L]
R60  value 1k  [R1608_0603I_L]
R61  value NP  [R1608_0603I_L]
R62  value 10k  [R1608_0603I_L]
R63  value 10k  [R1608_0603I_L]
R64  value 56  [R1608_0603I_L]
R65  value 56  [R1608_0603I_L]
R66  value NP  [R1608_0603I_L]
SB6  SD_JUMP  [SOLDER_JUMPER]  (value not drawn)
T8  (no value)
U7  TJA1027T_20_1J  [SOIC127P600X175-8N]
U8  MCP2562FDT-E/SN  [FP-C04-057-SN-MFG]

### Ports
CAN2_RX (bidir), CAN2_TX (bidir), CAN_STBY (in), CANH (bidir), CANL (bidir), LIN_BUS (bidir), LIN_RXD (bidir), LIN_SLP (in), LIN_TXD (bidir)

### Nets
+3V3: R57.1 R58.1 R59.1 R62.1 R63.1 U8.5(VIO)
+5: C38.2 D3.2(A) U8.3(VDD)
+12: D4.2(A)
GND: C35.1 C36.1 C37.2 C38.1 D6.1(C1) D7.3(GND) R61.1 R66.2 U7.5(GND) U8.2(VSS)
CAN2_RX: R62.2 U8.4(RXD) ; port CAN2_RX
CAN2_TX: R63.2 U8.1(TXD) ; port CAN2_TX
CAN_STBY: R66.1 U8.8(STBY) ; port CAN_STBY
CANH: D7.1(CANL) R64.1 U8.7(CANH) ; port CANH
CANL: D7.2(CANH) R65.1 U8.6(CANL) ; port CANL
LIN_BUS: C37.1 D6.2(C2) R60.2 U7.6(LIN) ; port LIN_BUS
LIN_SLP: R58.2 R61.2 U7.2(SLP_N) ; port LIN_SLP
USART5_RX: R59.2 U7.1(RXD) ; port LIN_RXD
USART5_TX: R57.2 U7.4(TXD) ; port LIN_TXD
VBAT: C35.2 C36.2 D3.1(K) D4.1(K) D5.2(A) U7.7(VBAT)  [project net VBAT_8]
NetD5_1: D5.1(K) R60.1
NetR64_2: R64.2 R65.2 SB6.1 SB6.2

Not connected (* = marked no-connect by the designer): U7 3(N.C._1)* 8(N.C._2)*

### Notes on the sheet
- (in symbol Title block) Project title:; Sheet title:; Version:; Author:; Date:; Approved by:

### Library data of the parts
C35 C38 = C: Capacitor; Code: NB6-100N
C36 = C: Capacitor; Code: NB7-4U7-25V
C37 = C: Capacitor; Code: NB4-1N
D3-D5 = BAT54HT1G: Schottky Barrier Diode, 2-Pin SOD-323, Pb-Free, Tape and Reel; Manufacturer: ON Semiconductor / Fairchild; Configuration: Single; trr Max (ns): 5; IFSM Max (A): 0.6; Code: KDBAT54H; ComponentLink3URL: http://www.onsemi.com/pub_link/Collateral/477-02.PDF.1; PackageDescription: 2-Pin SOD, Body 1.7 x 1.25 mm; ComponentLink2URL: http://www.onsemi.cn/pub_link/Collateral/BAT54HT1-D.PDF; ComponentLink3Description: Package Specification; ComponentLink2Description: Datasheet; DatasheetVersion: Rev. 6; PackageReference: SOD-323-2-477-02; RoHS: TRUE; ComponentLink1URL: http://www.onsemi.com/; Packing: Tape and Reel; PartNumber: BAT54HT1G; Mounting Technology: Surface Mount; ComponentLink1Description: Manufacturer URL; PackageVersion: Rev. H, 03/2007; Manufacturer Part Number: BAT54HT1G
D6 = PESD1LIN: LIN-bus ESD protection diode; Code: KD-PESD1LIN
D7 = NUP2125: SOT23127P600-8N / Dual Line Automotive Bus protection / Datasheet: https://www.onsemi.com/pdf/datasheet/nup2125-d.pdf; Code: KD-NUP2125
R57-R59 R62 R63 = R: Code: LC5-10K
R60 = R: Code: LC4-1K
R61 R66 = R
R64 R65 = R: Code: LC2-56E
T8 = Title block
U7 = TJA1027T_20_1J: Integrated Circuit, LIN Transciever / DataSheet: / https://www.nxp.com/docs/en/data-sheet/TJA1027.pdf; Manufacturer_Name: NXP; Manufacturer_Part_Number: TJA1027T/20/1J; Code: FC-TJA1027; Datasheet Link: http://www.nxp.com/docs/en/data-sheet/TJA1027.pdf; Height: 1.75mm; Mouser Part Number: 771-TJA1027T/20/1J; Mouser Price/Stock: https://www.mouser.co.uk/ProductDetail/NXP-Semiconductors/TJA1027T-20-1J?qs=8qdoF%2F2f1vr94fCG5MNBhg%3D%3D; Arrow Part Number: TJA1027T/20/1J; Arrow Price/Stock: https://www.arrow.com/en/products/tja1027t201j/nxp-semiconductors
U8 = MCP2562FDT-E/SN: IC TRANSCEIVER 1/1 8SOIC; Operating Supply Current: 70mA; Data Rate: 8Mbps; Number of Transceivers: 1; Receiver Hysteresis: 200mV; Max Supply Voltage: 5.5V; Min Supply Voltage: 4.5V; Code: FC-MCP2562FD; Weight: 0.019048oz; Package Quantity: 3300; Case/Package: SOIC; Mount: Surface Mount; Max Operating Temperature: 125°C; Min Operating Temperature: -40°C; Packaging: Tape and Reel; Number of Pins: 8

## Sheet STLINK_2.1.SchDoc: MISKO 3.0
size A4; Date: 19.9.2021; Author: AMADEJ PAPEŽ; SheetNumber: 5; SheetTotal: 13; SheetTitle: STLINK_2.1; Version: V1.1
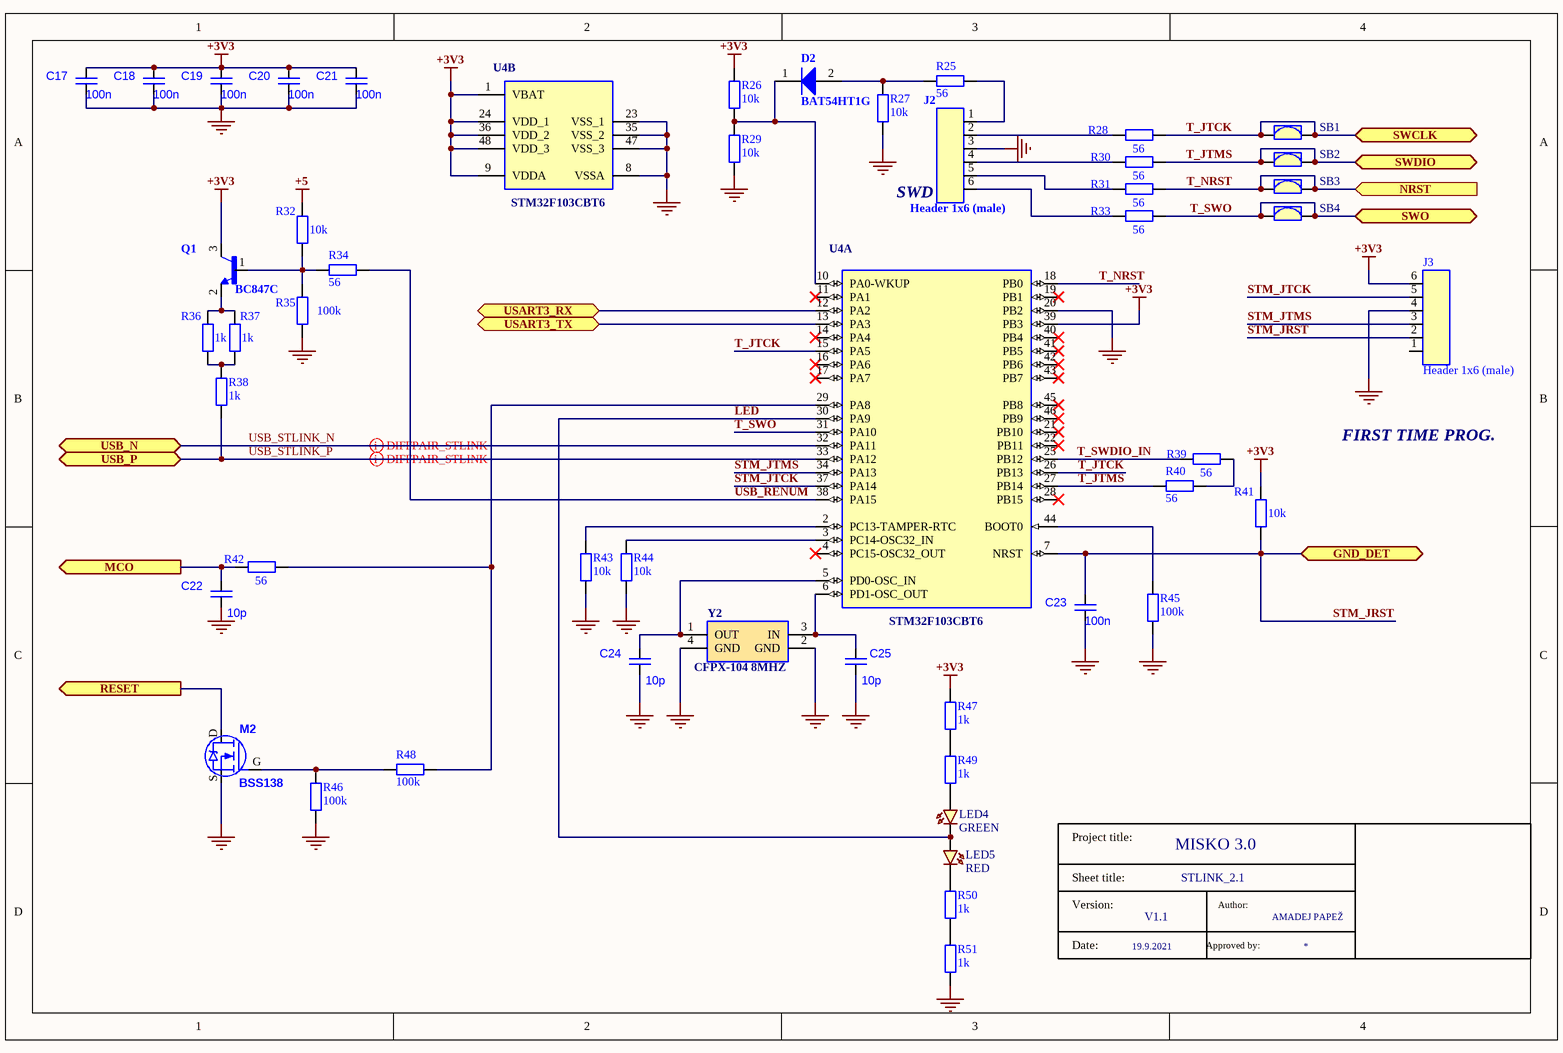
[diagram p7: STLINK_2.1.SchDoc]

### Parts
C17  value 100n  [C0603]
C18  value 100n  [C0603]
C19  value 100n  [C0603]
C20  value 100n  [C0603]
C21  value 100n  [C0603]
C22  value 10p  [C0603]
C23  value 100n  [C0603]
C24  value 10p  [C0603]
C25  value 10p  [C0603]
D2  BAT54HT1G  [ONSC-SOD-323-2-477-02_V]
J2  Header 1x6 (male)  [H1x6]
J3  Header 1x6 (male)  [H1x6_no3D]
LED4  GREEN  [LED0603]
LED5  RED  [LED0603]
M2  BSS138  [SOT23-3_L]
Q1  BC847C  [SOT23-3_L]
R25  value 56  [R1608_0603I_L]
R26  value 10k  [R1608_0603I_L]
R27  value 10k  [R1608_0603I_L]
R28  value 56  [R1608_0603I_L]
R29  value 10k  [R1608_0603I_L]
R30  value 56  [R1608_0603I_L]
R31  value 56  [R1608_0603I_L]
R32  value 10k  [R1608_0603I_L]
R33  value 56  [R1608_0603I_L]
R34  value 56  [R1608_0603I_L]
R35  value 100k  [R1608_0603I_L]
R36  value 1k  [R1608_0603I_L]
R37  value 1k  [R1608_0603I_L]
R38  value 1k  [R1608_0603I_L]
R39  value 56  [R1608_0603I_L]
R40  value 56  [R1608_0603I_L]
R41  value 10k  [R1608_0603I_L]
R42  value 56  [R1608_0603I_L]
R43  value 10k  [R1608_0603I_L]
R44  value 10k  [R1608_0603I_L]
R45  value 100k  [R1608_0603I_L]
R46  value 100k  [R1608_0603I_L]
R47  value 1k  [R1608_0603I_L]
R48  value 100k  [R1608_0603I_L]
R49  value 1k  [R1608_0603I_L]
R50  value 1k  [R1608_0603I_L]
R51  value 1k  [R1608_0603I_L]
SB1  SD_JUMP  [SOLDER_JUMPER]  (value not drawn)
SB2  SD_JUMP  [SOLDER_JUMPER]  (value not drawn)
SB3  SD_JUMP  [SOLDER_JUMPER]  (value not drawn)
SB4  SD_JUMP  [SOLDER_JUMPER]  (value not drawn)
T5  (no value)
U4  STM32F103CBT6  [STM-LQFP48_L]  (parts A,B of 2)
Y2  CFPX-104 8MHZ  [ABM3B8MHZB2T]

### Ports
GND_DET (bidir), MCO (out), NRST (in), RESET (out), SWCLK (bidir), SWDIO (bidir), SWO (bidir), USART3_RX (bidir), USART3_TX (bidir), USB_N (bidir), USB_P (bidir)

### Nets
+3V3: C17.2 C18.2 C19.2 C20.2 C21.2 J3.6 Q1.3(C) R26.1 R41.1 R47.2 U4.1(VBAT) U4.9(VDDA) U4.24(VDD_1) U4.36(VDD_2) U4.39(PB3) U4.48(VDD_3)
+5: R32.1
GND: C17.1 C18.1 C19.1 C20.1 C21.1 C22.1 C23.1 C24.1 C25.1 J2.3 J3.4 M2.S R27.1 R29.1 R35.2 R43.2 R44.2 R45.1 R46.2 R51.2 U4.8(VSSA) U4.20(PB2) U4.23(VSS_1) U4.35(VSS_2) U4.47(VSS_3) Y2.2(GND) Y2.4(GND)
LED: LED4.1(KATODE) LED5.2(ANODE) U4.30(PA9)  [project net LED_5]
MCI: C22.2 R42.1 ; port MCO
STM_JRST: C23.2 J3.2 R41.2 U4.7(NRST) ; port GND_DET
STM_JTCK: J3.5 U4.37(PA14)  [project net STM_JTCK_5]
STM_JTMS: J3.3 U4.34(PA13)  [project net STM_JTMS_5]
T_JTCK: R28.2 SB1.1 SB1.2 U4.15(PA5) U4.26(PB13) ; port SWCLK
T_JTMS: R30.2 R40.2 SB2.1 SB2.2 U4.27(PB14) ; port SWDIO
T_NRST: M2.D R31.2 SB3.1 SB3.2 U4.18(PB0) ; port NRST, port RESET  [project net NRST]
T_SWDIO_IN: R39.1 U4.25(PB12)  [project net T_SWDIO_IN_5]
T_SWO: R33.2 SB4.1 SB4.2 U4.31(PA10) ; port SWO
USART3_RX: U4.12(PA2) ; port USART3_RX
USART3_TX: U4.13(PA3) ; port USART3_TX
USB_RENUM: R34.2 U4.38(PA15)  [project net USB_RENUM_5]
USB_STLINK_N: U4.32(PA11) ; port USB_N
USB_STLINK_P: R38.1 U4.33(PA12) ; port USB_P
NetC24_2: C24.2 U4.5(PD0-OSC_IN) Y2.1(OUT)
NetC25_2: C25.2 U4.6(PD1-OSC_OUT) Y2.3(IN)
NetD2_1: D2.1(K) R26.2 R29.2 U4.10(PA0-WKUP)
NetD2_2: D2.2(A) R25.2 R27.2
NetJ2_1: J2.1 R25.1
NetJ2_2: J2.2 R28.1
NetJ2_4: J2.4 R30.1
NetJ2_5: J2.5 R31.1
NetJ2_6: J2.6 R33.1
NetLED4_2: LED4.2(ANODE) R49.1
NetLED5_1: LED5.1(KATODE) R50.1
NetM2_G: M2.G R46.1 R48.2
NetQ1_1: Q1.1(B) R32.2 R34.1 R35.1
NetQ1_2: Q1.2(E) R36.2 R37.2
NetR36_1: R36.1 R37.1 R38.2
NetR39_2: R39.2 R40.1
NetR42_2: R42.2 R48.1 U4.29(PA8)
NetR43_1: R43.1 U4.2(PC13-TAMPER-RTC)
NetR44_1: R44.1 U4.3(PC14-OSC32_IN)
NetR45_2: R45.2 U4.44(BOOT0)
NetR47_1: R47.1 R49.2
NetR50_2: R50.2 R51.1

Not connected (* = marked no-connect by the designer): J3 1; U4 4(PC15-OSC32_OUT)* 11(PA1)* 14(PA4)* 16(PA6)* 17(PA7)* 19(PB1)* 21(PB10)* 22(PB11)* 28(PB15)* 40(PB4)* 41(PB5)* 42(PB6)* 43(PB7)* 45(PB8)* 46(PB9)*

### Layout directives
differential pair: USB_STLINK_N, USB_STLINK_P

### Notes on the sheet
- SWD
- FIRST TIME PROG.
- (in symbol Title block) Project title:; Sheet title:; Version:; Author:; Date:; Approved by:

### Library data of the parts
C17-C21 C23 = C: Capacitor; Code: NB6-100N
C22 C24 C25 = C: Capacitor; Code: NB2-10P
D2 = BAT54HT1G: as D3 on sheet CAN + LIN; ComponentLink3URL: http://www.onsemi.com/pub_link/Collateral/477-02.PDF.1; PackageDescription: 2-Pin SOD, Body 1.7 x 1.25 mm; ComponentLink2URL: http://www.onsemi.cn/pub_link/Collateral/BAT54HT1-D.PDF; ComponentLink3Description: Package Specification; ComponentLink2Description: Datasheet; DatasheetVersion: Rev. 6; PackageReference: SOD-323-2-477-02; RoHS: TRUE; ComponentLink1URL: http://www.onsemi.com/; Packing: Tape and Reel; PartNumber: BAT54HT1G; Mounting Technology: Surface Mount; ComponentLink1Description: Manufacturer URL; PackageVersion: Rev. H, 03/2007; Manufacturer Part Number: BAT54HT1G
J2 J3 = H1x6
LED4 = LED: Green light-emitting diode; Code: KLC-G
LED5 = LED: Red light-emitting diode; Code: KLC-R
M2 = BSH103: BSH103-T/R (NMOS); pin to pad: D>3 G>1 S>2; Code: BSH103-T/R
Q1 = BC847C: Bipolar (BJT) Transistor NPN 45V 100mA 100MHz 250mW Surface Mount TO-236AB; MF: Nexperia USA; Code: KT-NPN-S; MP: BC847C; Package: SOT-23 Nexperia USA; Availability: Unavailable; Price: None; Arrow_Electronics-Purchase-URL: https://snapeda.com/shop?store=Arrow+Electronics&id=590780; SnapEDA_Link: https://www.snapeda.com/parts/BC847C/Nexperia%20USA%20Inc./view-part/590780/?ref=snap; Value: *; KT-NPN-S: *
R25 R28 R30 R31 R33 R34 R39 R40 R42 = R: Code: LC2-56E
R26 R27 R29 R32 R41 R43 R44 = R: Code: LC5-10K
R35 R45 R46 R48 = R: Code: LC6-100K
R36-R38 R47 R49-R51 = R: Code: LC4-1K
T5 = Title block
U4 = STM32F103CBT6: ARM Cortex-M3 32-bit MCU, 128 KB Flash, 20 KB Internal RAM, 37 I/Os, 48-pin LQFP, -40 to 85 degC, Tray / DataSheet: / https://www.st.com/resource/en/datasheet/stm32f103c8.pdf / About STLINK: / https://www.st.com/resource/en/user_manual/dm00231744-stm32-nucleo-32-boards-mb1180-stmicroelectronics.pdf; Supply Voltage(Vcc) min (V): 2; Operating Frequency(F) (Processor speed) (MHz): 72; A/D Converter: 2x12-bit (10 Channel); FLASH Size (Prog) (kB): 128; Internal RAM Size (kB): 20; I/Os (High Current): 37; Code: BSTM32F103CBT6; ComponentLink2Description: Datasheet; PackageReference: LQFP48; PartNumber: STM32F103CBT6; ComponentLink1Description: Manufacturer URL; DatasheetVersion: Rev. 16; PackageVersion: Rev. 6, 06/2013; Packing: Tray; ComponentLink1URL: http://www.st.com/web/en/home.html; Mounting Technology: Surface Mount; ComponentLink3URL: http://www.st.com/st-web-ui/static/active/en/resource/technical/document/datasheet/DM00058181.pdf; PackageDescription: 48-Pin Low Profile Quad Flat Package, 7 x 7 mm Body, 0.5 mm Pitch; Core: ARM Cortex-M3; ComponentLink3Description: Package Specification; ComponentLink2URL: http://www.st.com/st-web-ui/static/active/en/resource/technical/document/datasheet/CD00161566.pdf; Manufacturer: STMicroelectronics; Manufacturer Part Number: STM32F103CBT6
Y2 = ABM3B-8MHZ-B-2-T: Manufacturer_Name: Würth elektronik; Manufacturer_Part_Number: 830055901; Datasheet Link: https://www.we-online.com/catalog/datasheet/830055901.pdf; Height: 1.1mm; Supplier 1: Würth elektronik; Supplier part number 1: 830055901

## Sheet MCU.SchDoc: MISKO 3.0
size A4; Date: 19.9.2021; Author: AMADEJ PAPEŽ; SheetNumber: 11; SheetTotal: 13; Version: V1.1; SheetTitle: MCU
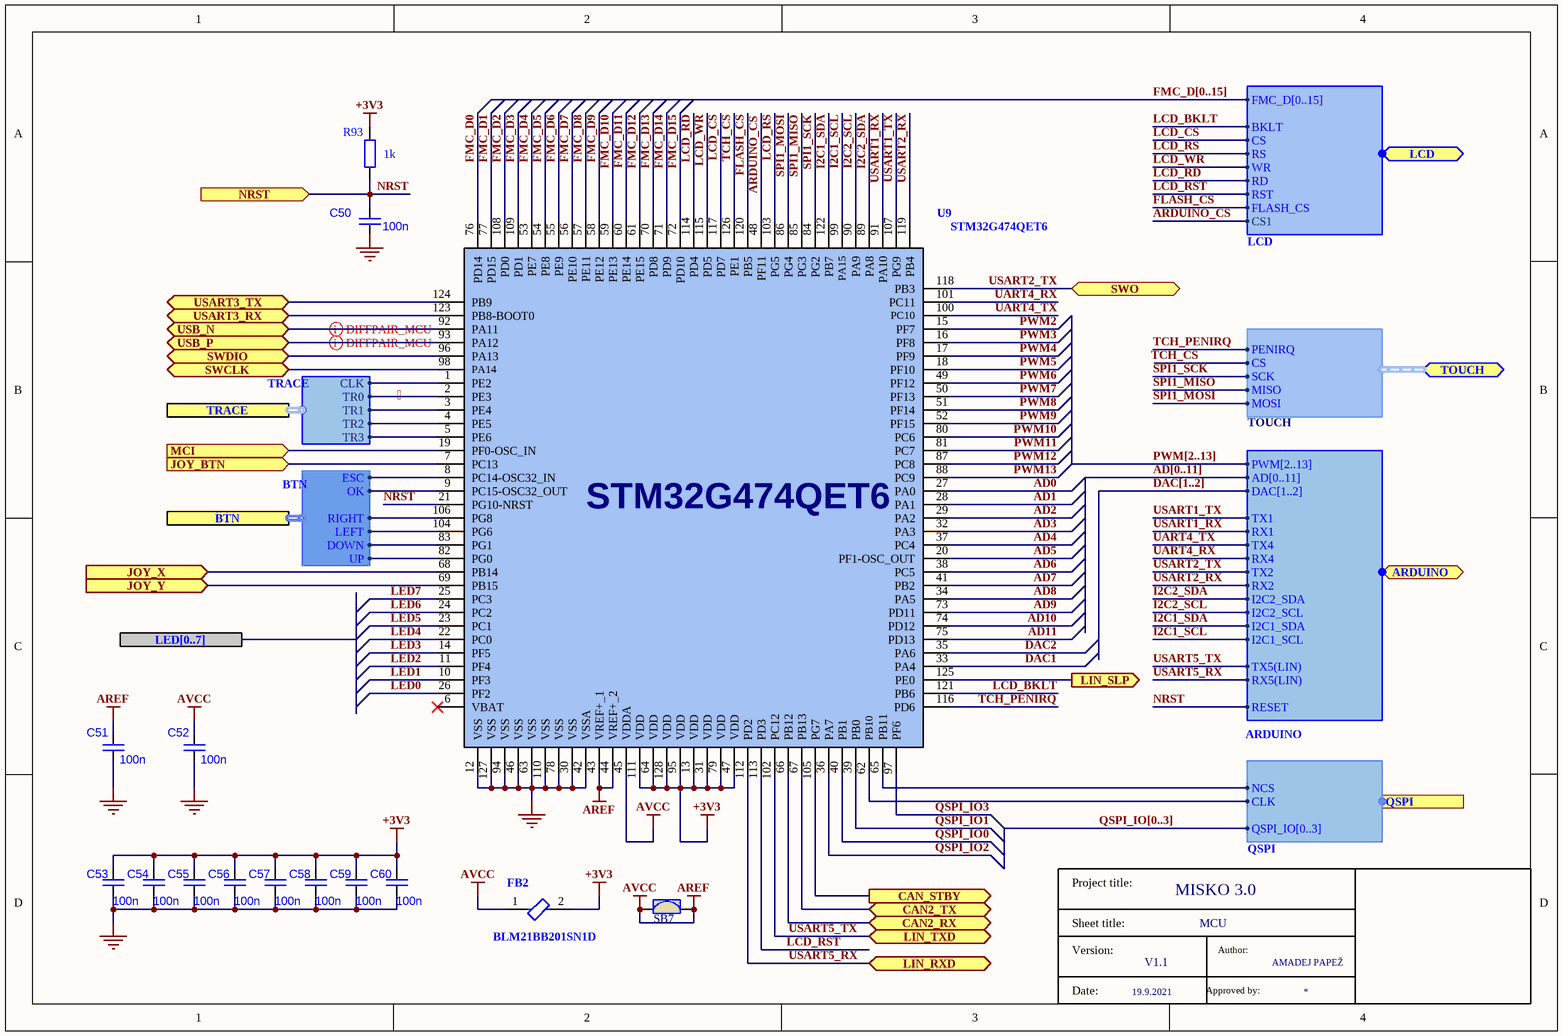
[diagram p8: MCU.SchDoc]

### Parts
C50  value 100n  [C0603]
C51  value 100n  [C0603]
C52  value 100n  [C0603]
C53  value 100n  [C0603]
C54  value 100n  [C0603]
C55  value 100n  [C0603]
C56  value 100n  [C0603]
C57  value 100n  [C0603]
C58  value 100n  [C0603]
C59  value 100n  [C0603]
C60  value 100n  [C0603]
FB2  BLM21BB201SN1D  [BLM2102FB0805]
R93  value 1k  [R1608_0603I_L]
SB7  SD_JUMP  [SOLDER_JUMPER]  (value not drawn)
T11  (no value)
U9  STM32G474QET6  [QFP40P1600X1600X160-128N]

### Ports
ARDUINO (bidir, harness ARDUINO), BTN (harness BTN), CAN2_RX (bidir), CAN2_TX (bidir), CAN_STBY (out), JOY_BTN (in), JOY_X (in), JOY_Y (in), LCD (bidir, harness LCD), LED[0..7] (harness LED), LIN_RXD (bidir), LIN_SLP (out), LIN_TXD (bidir), MCI (in), NRST (in), QSPI (harness QSPI), SWCLK (bidir), SWDIO (bidir), SWO (bidir), TOUCH (bidir, harness TOUCH), TRACE (harness TRACE), USART3_RX (bidir), USART3_TX (bidir), USB_N (bidir), USB_P (bidir)

### Harnesses
ARDUINO: PWM[2..13], DAC[1..2], TX1, RX1, TX4, RX4, TX2, RX2, I2C2_SDA, I2C2_SCL, I2C1_SDA, I2C1_SCL, AD[0..11], TX5(LIN), RX5(LIN), RESET
QSPI: NCS, CLK, QSPI_IO[0..3]
TRACE: CLK, TR0, TR1, TR2, TR3
BTN: LEFT, DOWN, RIGHT, UP, OK, ESC
LCD: FMC_D[0..15], RST, BKLT, RD, WR, RS, CS, FLASH_CS, CS1
TOUCH: PENIRQ, CS, SCK, MISO, MOSI

### Nets
+3V3: C53.2 C54.2 C55.2 C56.2 C57.2 C58.2 C59.2 C60.2 FB2.2 R93.1 U9.13(VDD) U9.31(VDD) U9.47(VDD) U9.64(VDD) U9.79(VDD) U9.95(VDD) U9.111(VDD) U9.128(VDD)
AREF: C51.2 C52.2 FB2.1 SB7.1 SB7.2 U9.43(VREF+_1) U9.44(VREF+_2) U9.45(VDDA)  [also labelled AVCC]
GND: C50.1 C51.1 C52.1 C53.1 C54.1 C55.1 C56.1 C57.1 C58.1 C59.1 C60.1 U9.12(VSS) U9.30(VSS) U9.42(VSSA) U9.46(VSS) U9.63(VSS) U9.78(VSS) U9.94(VSS) U9.110(VSS) U9.127(VSS)
AD0: U9.27(PA0)
AD1: U9.28(PA1)
AD2: U9.29(PA2)
AD3: U9.32(PA3)
AD4: U9.37(PC4)
AD5: U9.20(PF1-OSC_OUT)
AD6: U9.38(PC5)
AD7: U9.41(PB2)
AD8: U9.34(PA5)
AD9: U9.73(PD11)
AD10: U9.74(PD12)
AD11: U9.75(PD13)
ARDUINO_CS: U9.48(PF11) ; port LCD.CS1
CAN2_RX: U9.66(PB12) ; port CAN2_RX
CAN2_TX: U9.67(PB13) ; port CAN2_TX
CAN_STBY: U9.105(PG7) ; port CAN_STBY
DAC1: U9.33(PA4)
DAC2: U9.35(PA6)
FLASH_CS: U9.120(PB5) ; port LCD.FLASH_CS
FMC_D0: U9.76(PD14)
FMC_D1: U9.77(PD15)
FMC_D2: U9.108(PD0)
FMC_D3: U9.109(PD1)
FMC_D4: U9.53(PE7)
FMC_D5: U9.54(PE8)
FMC_D6: U9.55(PE9)
FMC_D7: U9.56(PE10)
FMC_D8: U9.57(PE11)
FMC_D9: U9.58(PE12)
FMC_D10: U9.59(PE13)
FMC_D11: U9.60(PE14)
FMC_D12: U9.61(PE15)
FMC_D13: U9.70(PD8)
FMC_D14: U9.71(PD9)
FMC_D15: U9.72(PD10)
I2C1_SCL: U9.99(PA15) ; port ARDUINO.I2C1_SCL
I2C1_SDA: U9.122(PB7) ; port ARDUINO.I2C1_SDA
I2C2_SCL: U9.90(PA9) ; port ARDUINO.I2C2_SCL
I2C2_SDA: U9.89(PA8) ; port ARDUINO.I2C2_SDA
JOY_BTN: U9.7(PC13) ; port JOY_BTN
JOY_X: U9.68(PB14) ; port JOY_X
JOY_Y: U9.69(PB15) ; port JOY_Y
LCD_BKLT: U9.121(PB6) ; port LCD.BKLT
LCD_CS: U9.117(PD7) ; port LCD.CS
LCD_RD: U9.114(PD4) ; port LCD.RD
LCD_RS: U9.103(PG5) ; port LCD.RS
LCD_RST: U9.113(PD3) ; port LCD.RST
LCD_WR: U9.115(PD5) ; port LCD.WR
LED0: U9.26(PF2)  [project net LED0_11]
LED1: U9.10(PF3)  [project net LED1_11]
LED2: U9.11(PF4)  [project net LED2_11]
LED3: U9.14(PF5)  [project net LED3_11]
LED4: U9.22(PC0)  [project net LED4_11]
LED5: U9.23(PC1)  [project net LED5_11]
LED6: U9.24(PC2)  [project net LED6_11]
LED7: U9.25(PC3)  [project net LED7_11]
LIN_SLP: U9.125(PE0) ; port LIN_SLP
MCI: U9.19(PF0-OSC_IN) ; port MCI
NRST: C50.2 R93.2 U9.21(PG10-NRST) ; port NRST, port ARDUINO.RESET
PWM2: U9.15(PF7)
PWM3: U9.16(PF8)
PWM4: U9.17(PF9)
PWM5: U9.18(PF10)
PWM6: U9.49(PF12)
PWM7: U9.50(PF13)
PWM8: U9.51(PF14)
PWM9: U9.52(PF15)
PWM10: U9.80(PC6)
PWM11: U9.81(PC7)
PWM12: U9.87(PC8)
PWM13: U9.88(PC9)
QSPI_IO0: U9.40(PB1)
QSPI_IO1: U9.39(PB0)
QSPI_IO2: U9.36(PA7)
QSPI_IO3: U9.97(PF6)
SPI1_MISO: U9.85(PG3) ; port TOUCH.MISO  [project net MISO]
SPI1_MOSI: U9.86(PG4) ; port TOUCH.MOSI  [project net MOSI]
SPI1_SCK: U9.84(PG2) ; port TOUCH.SCK  [project net SCK]
T_JTCK: U9.98(PA14) ; port SWCLK
T_JTMS: U9.96(PA13) ; port SWDIO
TCH_CS: U9.126(PE1) ; port TOUCH.CS
TCH_PENIRQ: U9.116(PD6) ; port TOUCH.PENIRQ
UART4_RX: U9.101(PC11) ; port ARDUINO.RX4
UART4_TX: U9.100(PC10) ; port ARDUINO.TX4
USART1_RX: U9.91(PA10) ; port ARDUINO.RX1
USART1_TX: U9.107(PG9) ; port ARDUINO.TX1
USART2_RX: U9.119(PB4) ; port ARDUINO.RX2
USART2_TX: U9.118(PB3) ; port SWO, port ARDUINO.TX2  [project net T_SWO]
USART3_RX: U9.123(PB8-BOOT0) ; port USART3_RX
USART3_TX: U9.124(PB9) ; port USART3_TX
USART5_RX: U9.112(PD2) ; port LIN_RXD, port ARDUINO.RX5(LIN)
USART5_TX: U9.102(PC12) ; port LIN_TXD, port ARDUINO.TX5(LIN)
USB2_N: U9.92(PA11) ; port USB_N
USB2_P: U9.93(PA12) ; port USB_P
NetC43_2: U9.82(PG0) ; port BTN.UP
NetC44_2: U9.83(PG1) ; port BTN.DOWN
NetC45_2: U9.104(PG6) ; port BTN.LEFT
NetC47_2: U9.106(PG8) ; port BTN.RIGHT
NetC48_2: U9.9(PC15-OSC32_OUT) ; port BTN.OK
NetC49_2: U9.8(PC14-OSC32_IN) ; port BTN.ESC
NetIC1_1: U9.65(PB11) ; port QSPI.NCS
NetIC1_6: U9.62(PB10) ; port QSPI.CLK
NetJ12_12: U9.1(PE2) ; port TRACE.CLK
NetJ12_14: U9.2(PE3) ; port TRACE.TR0
NetJ12_16: U9.3(PE4) ; port TRACE.TR1
NetJ12_18: U9.4(PE5) ; port TRACE.TR2
NetJ12_20: U9.5(PE6) ; port TRACE.TR3

Not connected (* = marked no-connect by the designer): U9 6(VBAT)*

### Buses and harness runs
bus AD[0..11]
bus DAC[1..2]
bus FMC_D[0..15]
bus PWM[2..13]
bus QSPI_IO[0..3]

### Layout directives
differential pair: USB2_N, USB2_P

### Notes on the sheet
- Labels drawn without touching a wire or pin: 
- (in symbol Title block) Project title:; Sheet title:; Version:; Author:; Date:; Approved by:

### Library data of the parts
C50-C60 = C: Capacitor; Code: NB6-100N
FB2 = BLM21BB201SN1D: as FB1 on sheet POWER; Max Operating Temperature: 125°C; Packaging: Tape and Reel; REACH SVHC: No SVHC; Depth: 1.25mm; Core Material: Ferrite; Case Code (Metric): 2012; Termination: SMD/SMT; Series: BLM21B; Number of Lines: 1; Max Current Rating: 500mA; Package Quantity: 4000; Lead Free: Lead Free; Test Frequency: 100MHz; Case Code (Imperial): 0805; Number of Pins: 2; Height: 0.85mm; Tolerance: 25%; Width: 1.25mm; Case/Package: 0805; Min Operating Temperature: -55°C; Current Rating: 500mA; Length: 2mm
R93 = R: Code: LC4-1K
T11 = Title block
U9 = STM32G474QET6: Mainstream Arm Cortex - M3 MCU 170Mhz with 512 Kbytes of Flash memory, Math Accelerator, HR timer, High Analog level integration / DataSheet: / https://www.st.com/en/microcontrollers-microprocessors/stm32g474qe.html; Manufacturer_Name: STMicroelectronics; Code: BSTM32G474QET6; Datasheet Link: https://componentsearchengine.com/Datasheets/1/STM32G474QET6.pdf; Height: 1.6mm; Manufacturer_Part_Number: STM32G474QET6; Mouser Part Number: 511-STM32G474QET6; Mouser Price/Stock: https://www.mouser.co.uk/ProductDetail/STMicroelectronics/STM32G474QET6?qs=PzGy0jfpSMtk6tieSqAtNg%3D%3D; Arrow Part Number: STM32G474QET6; Arrow Price/Stock: https://www.arrow.com/en/products/stm32g474qet6/stmicroelectronics?region=nac

## Sheet USB_C.SchDoc: MISKO 3.0
size A4; Date: 19.9.2021; Author: AMADEJ PAPEŽ; SheetNumber: 2; SheetTotal: 13; SheetTitle: USB_C; Version: V1.1
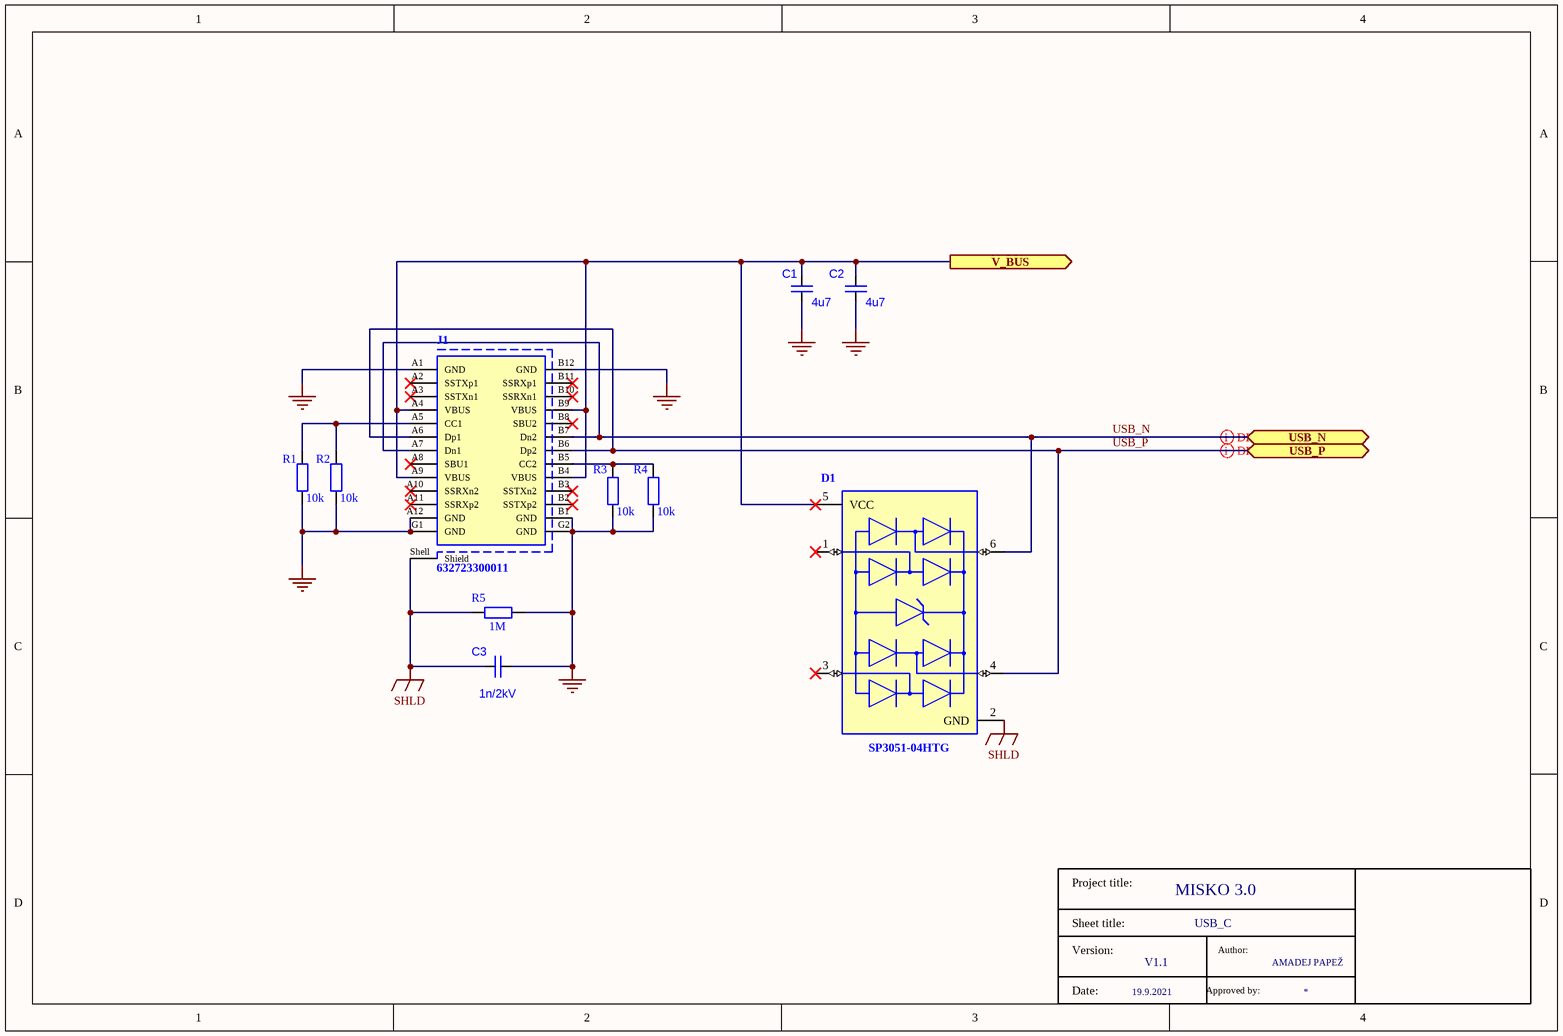
[diagram p9: USB_C.SchDoc]

### Parts
C1  value 4u7  [C0603]
C2  value 4u7  [C0603]
C3  value 1n/2kV  [C1206]
D1  SP3051-04HTG  [FP-SP3051-IPC_C]
J1  632723300011  [632723300011]
R1  value 10k  [R1608_0603I_L]
R2  value 10k  [R1608_0603I_L]
R3  value 10k  [R1608_0603I_L]
R4  value 10k  [R1608_0603I_L]
R5  value 1M  [R1608_0603I_L]
T2  (no value)

### Ports
USB_N (bidir), USB_P (bidir), V_BUS (out)

### Nets
GND: C1.1 C2.1 C3.1 J1.A1(GND) J1.A12(GND) J1.B1(GND) J1.B12(GND) J1.G1(GND) J1.G2(GND) R1.2 R2.2 R3.2 R4.2 R5.2
SHLD: C3.2 D1.2(GND) J1.Shell(Shield) R5.1
USB_N: D1.6(I/O_4) J1.A7(Dn1) J1.B7(Dn2) ; port USB_N
USB_P: D1.4(I/O_3) J1.A6(Dp1) J1.B6(Dp2) ; port USB_P
V_BUS: C1.2 C2.2 D1.5(VCC) J1.A4(VBUS) J1.A9(VBUS) J1.B4(VBUS) J1.B9(VBUS) ; port V_BUS
NetJ1_A5: J1.A5(CC1) R1.1 R2.1
NetJ1_B5: J1.B5(CC2) R3.1 R4.1

Not connected (* = marked no-connect by the designer): D1 1(I/O_1)* 3(I/O_2)*; J1 A2(SSTXp1)* A3(SSTXn1)* A8(SBU1)* A10(SSRXn2)* A11(SSRXp2)* B2(SSTXp2)* B3(SSTXn2)* B8(SBU2)* B10(SSRXn1)* B11(SSRXp1)*

### Layout directives
differential pair: USB_N, USB_P

### Notes on the sheet
- (in symbol Title block) Project title:; Sheet title:; Version:; Author:; Date:; Approved by:

### Library data of the parts
C1 C2 = C: Capacitor; Code: NB7-4U7-25V
C3 = C: Capacitor; Code: NH4-1N2KV
D1 = SP3051-04HTG: TVS DIODE 6V 17V SOT23-6; Manufacturer: Littelfuse; Peak Pulse Current: 20A; Capacitance: 1.7pF; Number Of Channels: 4; Breakdown Voltage: 8V; Standoff Height: 0mm; Direction: Unidirectional; Peak Pulse Power: 400W; Clamping Voltage: 14.3V; Code: KDSP3051; RoHS: TRUE; Temperature Range High: +125°C; Manufacturer Part Number: SP3051-04HTG; Automotive: No; Device Class L2: TVS Diodes; Reverse Standoff Voltage: 6V; ComponentLink2URL: https://www.littelfuse.com/~/media/electronics/datasheets/tvs_diode_arrays/littelfuse_tvs_diode_array_sp3051_datasheet.pdf.pdf; Mouser Description: TVS Diodes / ESD Suppressors 6V 20A for Lightning Surge PRO SOT23-6; Lead Free: Yes; Ipc Land Pattern Name: SOT95P280X118-6; Octopart: https://octopart.com/sp3051-04htg-littelfuse-29505621; Digikey Description: TVS DIODE 6V 17V SOT23-6; Device Class L3: unset; Temperature Range Low: -40°C; Height: 1.45mm; Temperature: -40°C to +125°C; Category: Diode; Package: SP3051; ComponentLink2Description: Datasheet; Device Class L1: Circuit Protection
J1 = 632723300011: USB 3.1 Type C Receptacle WR-COM, Horizontal, SMT / THT; Manufacturer: Wurth Electronics; Rated Current: 5A; Contact Resistance: 30mOhm; Working Voltage: 20VDC; Code: QBUSB-TYPEC-TM; Operating Temperature: -40to105degC; Package Reference: 632723300011; Datasheet URL: https://katalog.we-online.de/em/datasheet/632723x00011%282%29.pdf; Manufacturer URL: http://www.we-online.de; Connector Type: USB3.1TypeC; Gender: Receptacle; Part Number: 632723300011; Mounting Technology: SMT/THT; Publisher: WurthElektronik; Packaging: TapeandReel; Orientation: Horizontal; Manufacturer Part Number: 632723300011
R1-R4 = R: Code: LC5-10K
R5 = R: Code: LC7-1M
T2 = Title block

## Sheet QSPI.SchDoc: MIŠKO 3.0
size A4; Date: 19.9.2021; Author: AMADEJ PAPEŽ; SheetNumber: 12; SheetTotal: 13; Version: V1.1; SheetTitle: QSPI; Time: 1
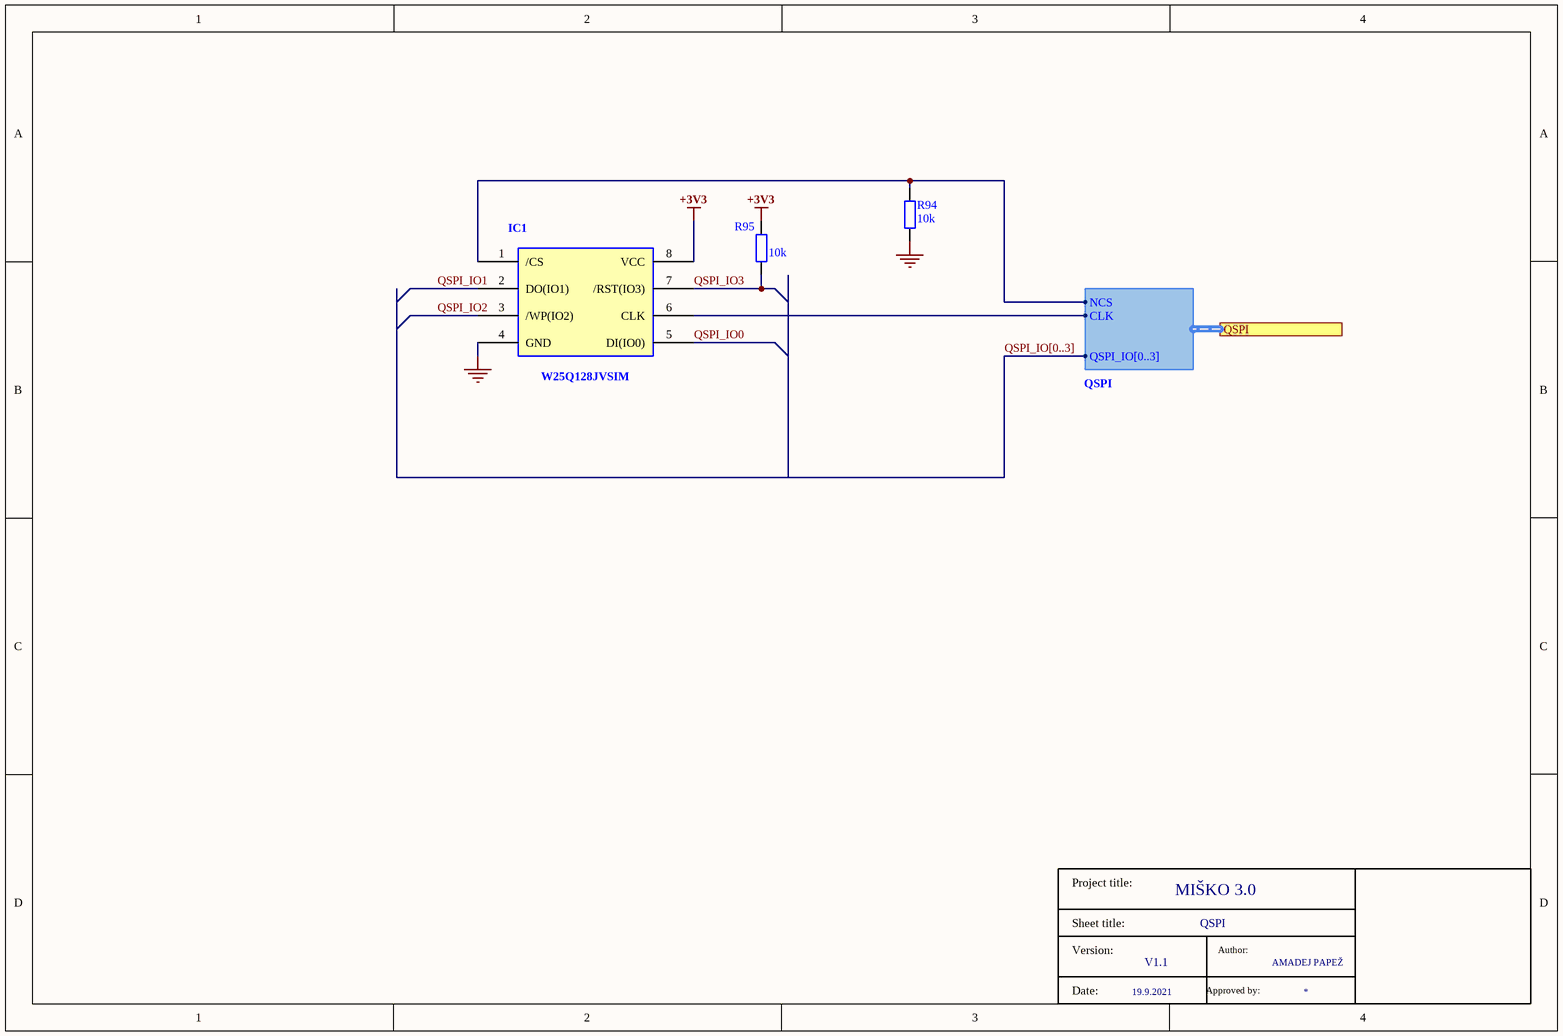
[diagram p10: QSPI.SchDoc]

### Parts
IC1  W25Q128JVSIM  [W25Q128JVSIM]
R94  value 10k  [R1608_0603I_L]
R95  value 10k  [R1608_0603I_L]
T12  (no value)

### Ports
QSPI (harness QSPI)

### Harnesses
QSPI: NCS, CLK, QSPI_IO[0..3]

### Nets
+3V3: IC1.8(VCC) R95.1
GND: IC1.4(GND) R94.2
QSPI_IO0: IC1.5(DI(IO0))
QSPI_IO1: IC1.2(DO(IO1))
QSPI_IO2: IC1.3(/WP(IO2))
QSPI_IO3: IC1.7(/RST(IO3)) R95.2
NetIC1_1: IC1.1(/CS) R94.1 ; port QSPI.NCS
NetIC1_6: IC1.6(CLK) ; port QSPI.CLK

### Buses and harness runs
bus QSPI_IO[0..3]

### Notes on the sheet
- (in symbol Title block) Project title:; Sheet title:; Version:; Author:; Date:; Approved by:

### Library data of the parts
IC1 = W25Q128JVSIM: FLASH - NOR Memory IC 128Mb (16M x 8) SPI - Quad I/O, QPI, DTR 133MHz 8-SOIC
R94 R95 = R: Code: LC5-10K
T12 = Title block

## Sheet LCD + TOUCH .SchDoc: MISKO 3.0
size A4; Date: 19.9.2021; Author: AMADEJ PAPEŽ; SheetNumber: 7; SheetTotal: 13; SheetTitle: LCD + TOUCH; Version: V1.1
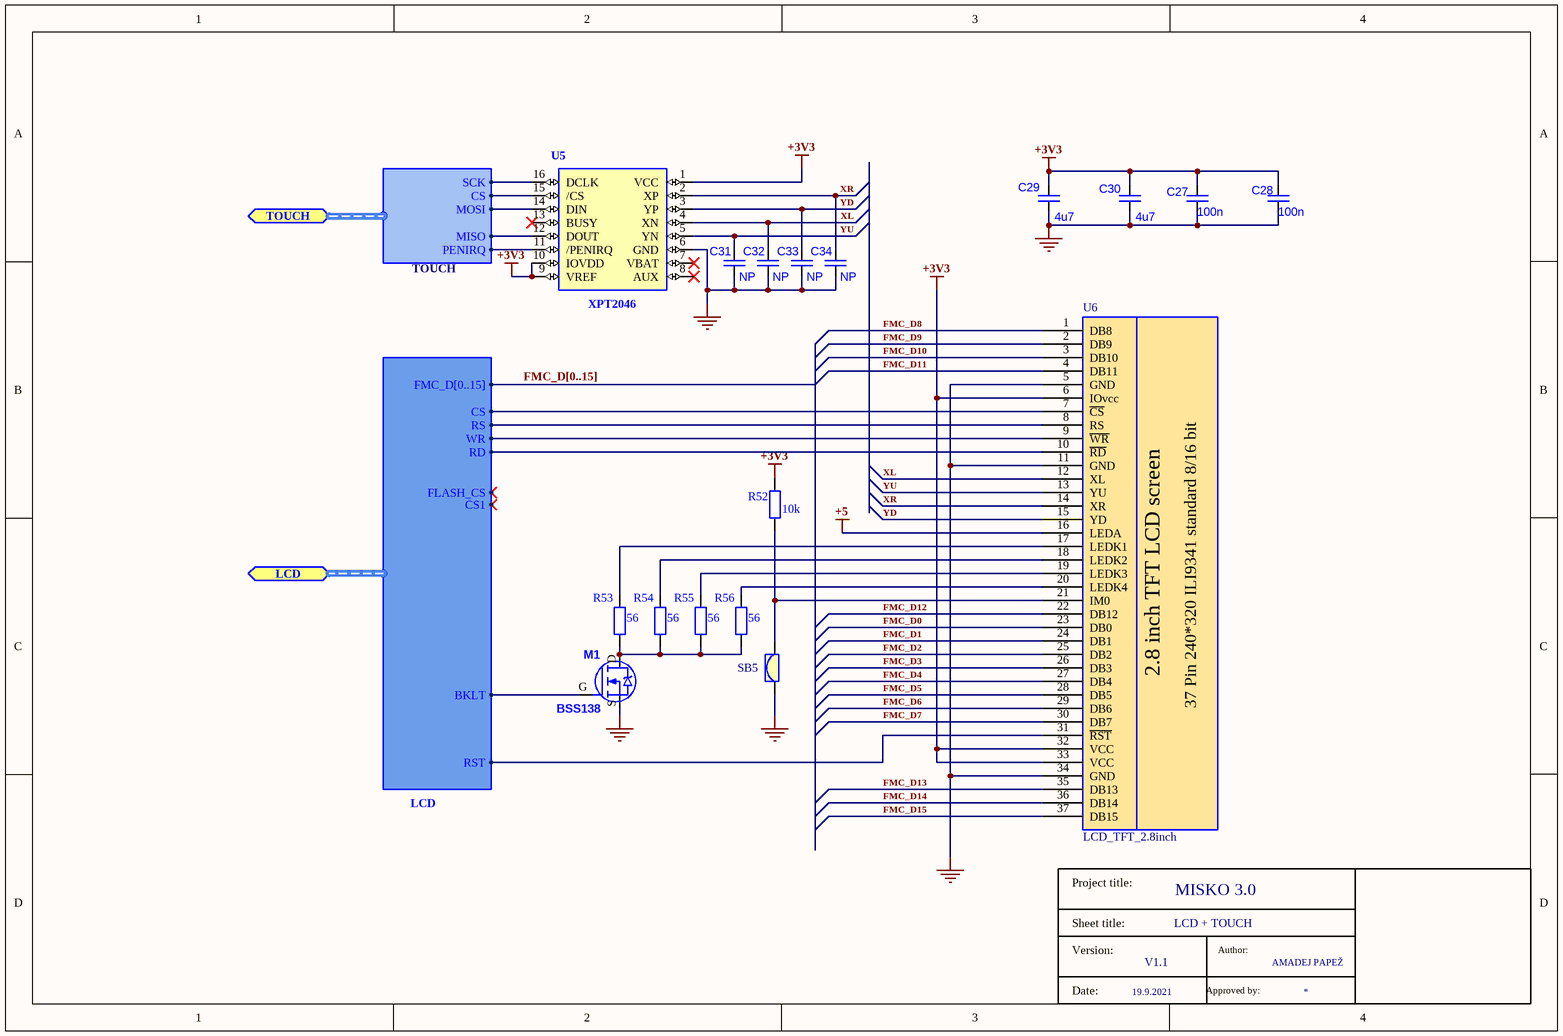
[diagram p11: LCD + TOUCH .SchDoc]

### Parts
C27  value 100n  [C0603]
C28  value 100n  [C0603]
C29  value 4u7  [C0603]
C30  value 4u7  [C0603]
C31  value NP  [C0603]
C32  value NP  [C0603]
C33  value NP  [C0603]
C34  value NP  [C0603]
M1  BSS138  [SOT23-3_L]
R52  value 10k  [R1608_0603I_L]
R53  value 56  [R1608_0603I_L]
R54  value 56  [R1608_0603I_L]
R55  value 56  [R1608_0603I_L]
R56  value 56  [R1608_0603I_L]
SB5  SD_JUMP  [SOLDER_JUMPER]  (value not drawn)
T7  (no value)
U5  XPT2046  [TSSOP16]
U6  LCD_TFT_2.8inch  [LCD_TFT_2.8inch]

### Ports
LCD (bidir, harness LCD), TOUCH (bidir, harness TOUCH)

### Harnesses
LCD: FMC_D[0..15], RST, BKLT, RD, WR, RS, CS, FLASH_CS, CS1
TOUCH: PENIRQ, CS, SCK, MISO, MOSI

### Nets
+3V3: C27.2 C28.2 C29.2 C30.2 R52.2 U5.1(VCC) U5.9(VREF) U5.10(IOVDD) U6.6(IOvcc) U6.32(VCC) U6.33(VCC)
+5: U6.16(LEDA)
GND: C27.1 C28.1 C29.1 C30.1 C31.1 C32.1 C33.1 C34.1 M1.S SB5.1 U5.6(GND) U6.5(GND) U6.11(GND) U6.34(GND)
FMC_D0: U6.23(DB0)
FMC_D1: U6.24(DB1)
FMC_D2: U6.25(DB2)
FMC_D3: U6.26(DB3)
FMC_D4: U6.27(DB4)
FMC_D5: U6.28(DB5)
FMC_D6: U6.29(DB6)
FMC_D7: U6.30(DB7)
FMC_D8: U6.1(DB8)
FMC_D9: U6.2(DB9)
FMC_D10: U6.3(DB10)
FMC_D11: U6.4(DB11)
FMC_D12: U6.22(DB12)
FMC_D13: U6.35(DB13)
FMC_D14: U6.36(DB14)
FMC_D15: U6.37(DB15)
LCD_BKLT: M1.G ; port LCD.BKLT
LCD_CS: U6.7(~{CS}) ; port LCD.CS
LCD_RD: U6.10(~{RD}) ; port LCD.RD
LCD_RS: U6.8(RS) ; port LCD.RS
LCD_RST: U6.31(~{RST}) ; port LCD.RST
LCD_WR: U6.9(~{WR}) ; port LCD.WR
MISO: U5.12(DOUT) ; port TOUCH.MISO
MOSI: U5.14(DIN) ; port TOUCH.MOSI
SCK: U5.16(DCLK) ; port TOUCH.SCK
TCH_CS: U5.15(/CS) ; port TOUCH.CS
TCH_PENIRQ: U5.11(/PENIRQ) ; port TOUCH.PENIRQ
XL: C32.2 U5.4(XN) U6.12(XL)  [project net XL_7]
XR: C34.2 U5.2(XP) U6.14(XR)  [project net XR_7]
YD: C33.2 U5.3(YP) U6.15(YD)  [project net YD_7]
YU: C31.2 U5.5(YN) U6.13(YU)  [project net YU_7]
NetM1_D: M1.D R53.1 R54.1 R55.1 R56.1
NetR52_1: R52.1 SB5.2 U6.21(IM0)
NetR53_2: R53.2 U6.17(LEDK1)
NetR54_2: R54.2 U6.18(LEDK2)
NetR55_2: R55.2 U6.19(LEDK3)
NetR56_2: R56.2 U6.20(LEDK4)

Not connected (* = marked no-connect by the designer): U5 7(VBAT)* 8(AUX)* 13(BUSY)*

### Buses and harness runs
bus FMC_D[0..15]

### Notes on the sheet
- (in symbol LCD_TFT_2.8inch) 2.8 inch TFT LCD screen; 37 Pin 240*320 ILI9341 standard 8/16 bit
- (in symbol Title block) Project title:; Sheet title:; Version:; Author:; Date:; Approved by:

### Library data of the parts
C27 C28 = C: Capacitor; Code: NB6-100N
C29 C30 = C: Capacitor; Code: NB7-4U7-25V
C31-C34 = C: Capacitor; Code: NB2-10P
M1 = BSH103: BSH103-T/R (NMOS); pin to pad: D>3 G>1 S>2; Code: BSH103-T/R
R52 = R: Code: LC5-10K
R53-R56 = R: Code: LC2-56E
T7 = Title block
U5 = XPT2046: LCD touch controller; MF: Xptek; Code: KLCD-XPT2046; Value: *; Package: Package; MP: XPT2046; Price: None; Check_prices: https://www.snapeda.com/parts/XPT2046/Xptek/view-part/5164510/?ref=eda; ComponentLink1Description: Supplier1; ComponentLink1URL: *; ComponentLink2Description: Supplier 1 code; ComponentLink2URL: *; Parameter 1: *

## Sheet Trace.SchDoc: MIŠKO 3.0
size A4; Date: 19.9.2021; Author: AMADEJ PAPEŽ; SheetNumber: 13; SheetTotal: 13; SheetTitle: TRACE; Version: V1.1
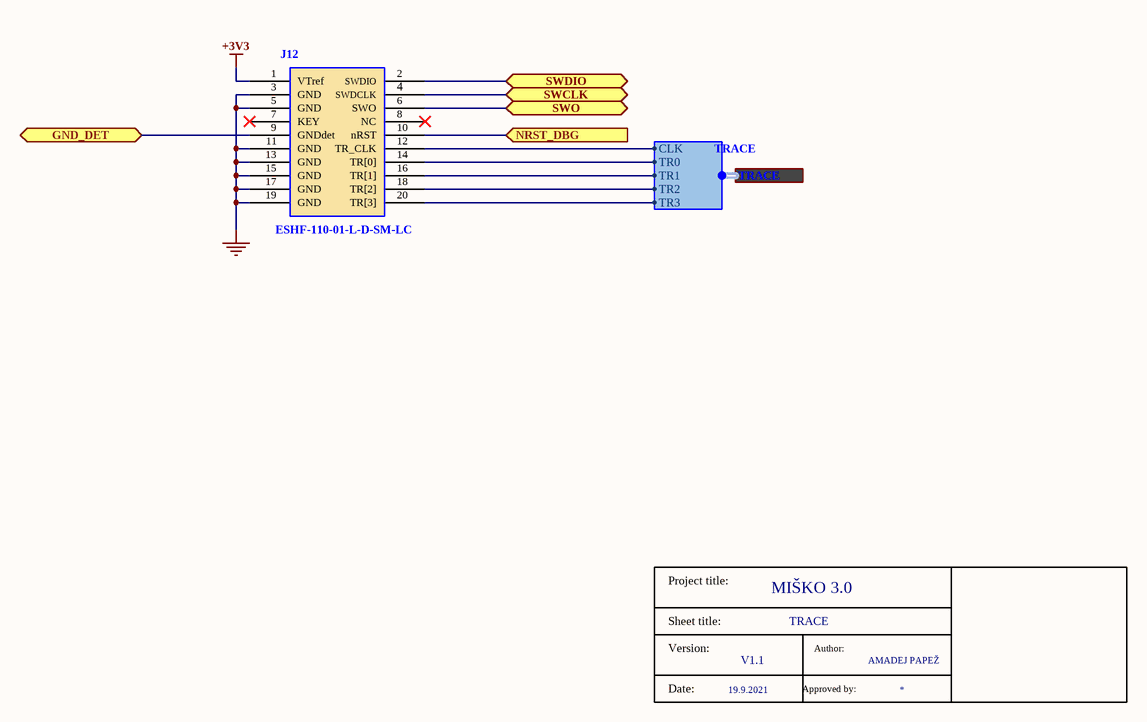
[diagram p12: Trace.SchDoc]

### Parts
J12  ESHF-110-01-L-D-SM-LC  [ESHF-110-01-L-D-SM-LC]
T13  (no value)

### Ports
GND_DET (bidir), NRST_DBG (in), SWCLK (bidir), SWDIO (bidir), SWO (bidir), TRACE (harness TRACE)

### Harnesses
TRACE: CLK, TR0, TR1, TR2, TR3

### Nets
+3V3: J12.1(VTref)
GND: J12.3(GND) J12.5(GND) J12.11(GND) J12.13(GND) J12.15(GND) J12.17(GND) J12.19(GND)
NRST: J12.10(nRST) ; port NRST_DBG
STM_JRST: J12.9(GNDdet) ; port GND_DET
T_JTCK: J12.4(SWDCLK) ; port SWCLK
T_JTMS: J12.2(SWDIO) ; port SWDIO
T_SWO: J12.6(SWO) ; port SWO
NetJ12_12: J12.12(TR_CLK) ; port TRACE.CLK
NetJ12_14: J12.14(TR[0]) ; port TRACE.TR0
NetJ12_16: J12.16(TR[1]) ; port TRACE.TR1
NetJ12_18: J12.18(TR[2]) ; port TRACE.TR2
NetJ12_20: J12.20(TR[3]) ; port TRACE.TR3

Not connected (* = marked no-connect by the designer): J12 7(KEY)* 8(NC)*

### Notes on the sheet
- (in symbol Title block) Project title:; Sheet title:; Version:; Author:; Date:; Approved by:

### Library data of the parts
J12 = ESHF-110-01-L-D-SM-LC: Trace/JTAG/SW connector; Code: QYS50-20-M-SMD-LC
T13 = Title block